# EAGLE board 030Card (EAGLE 8.2.2), part 1 of 2
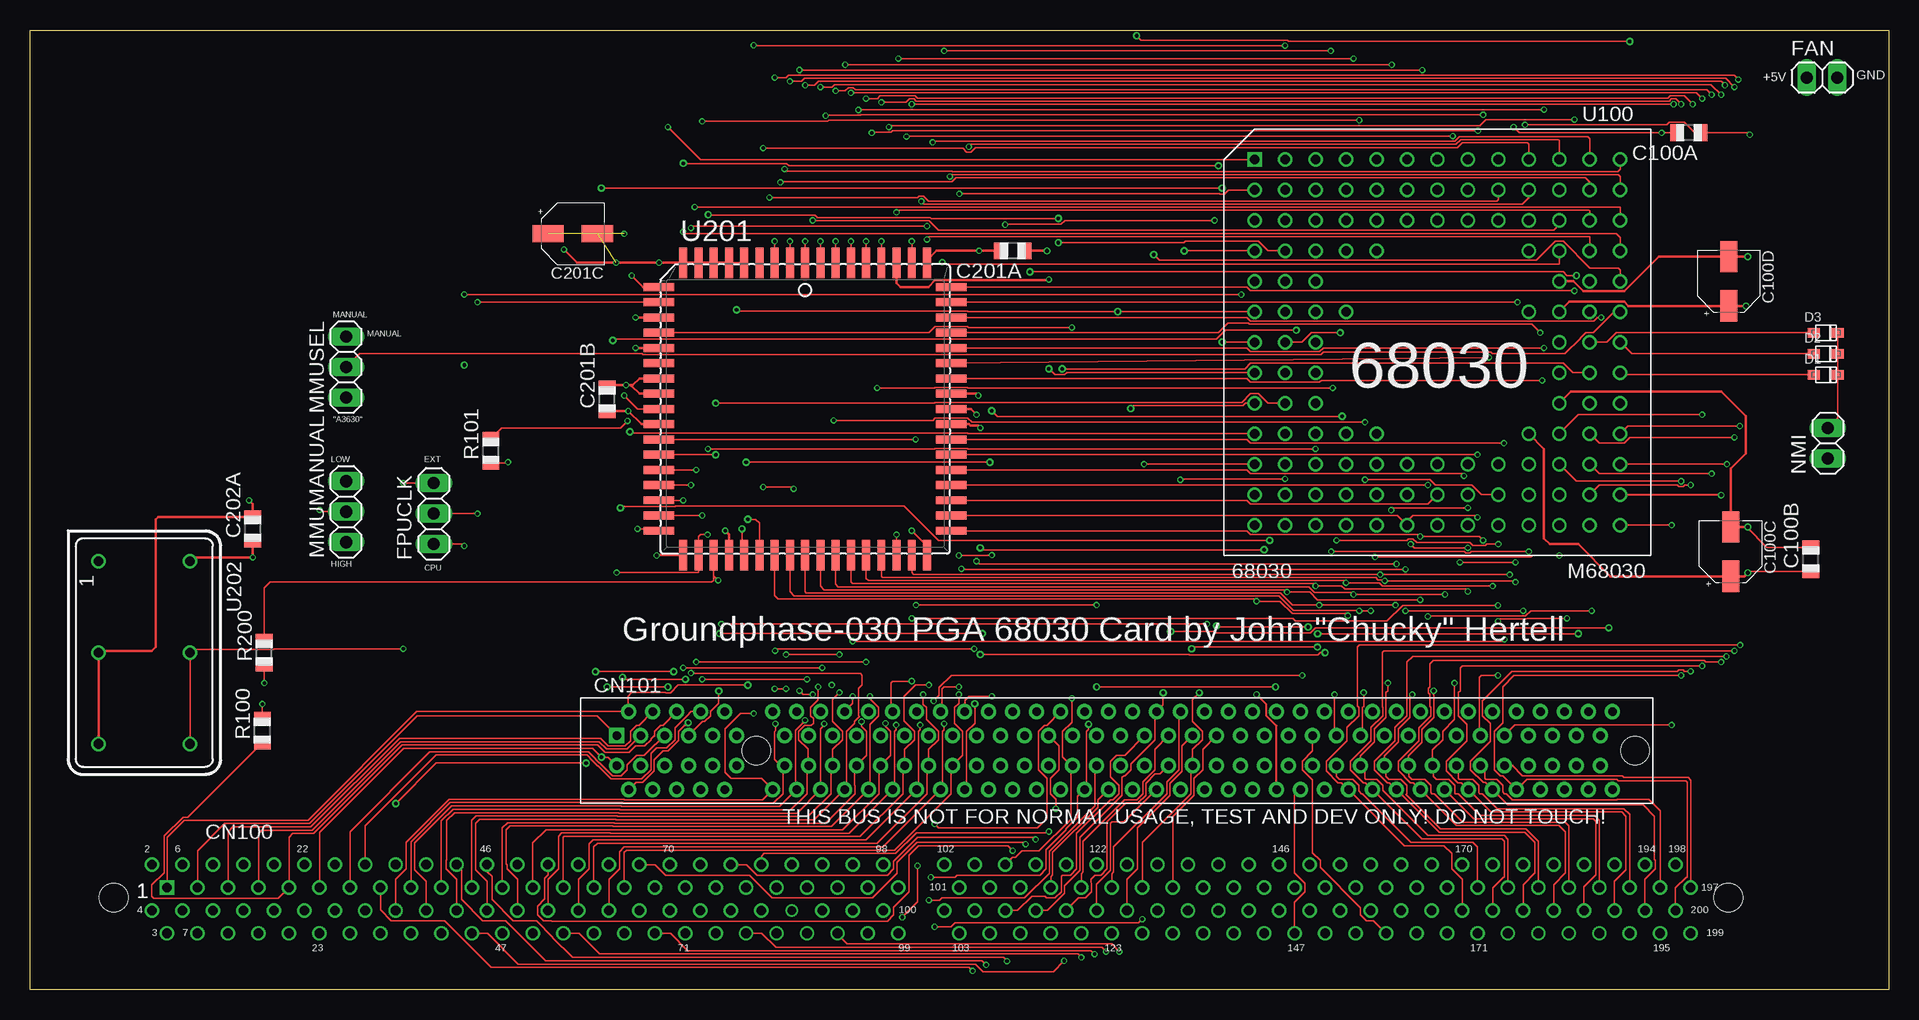
[diagram p2: board, top side]
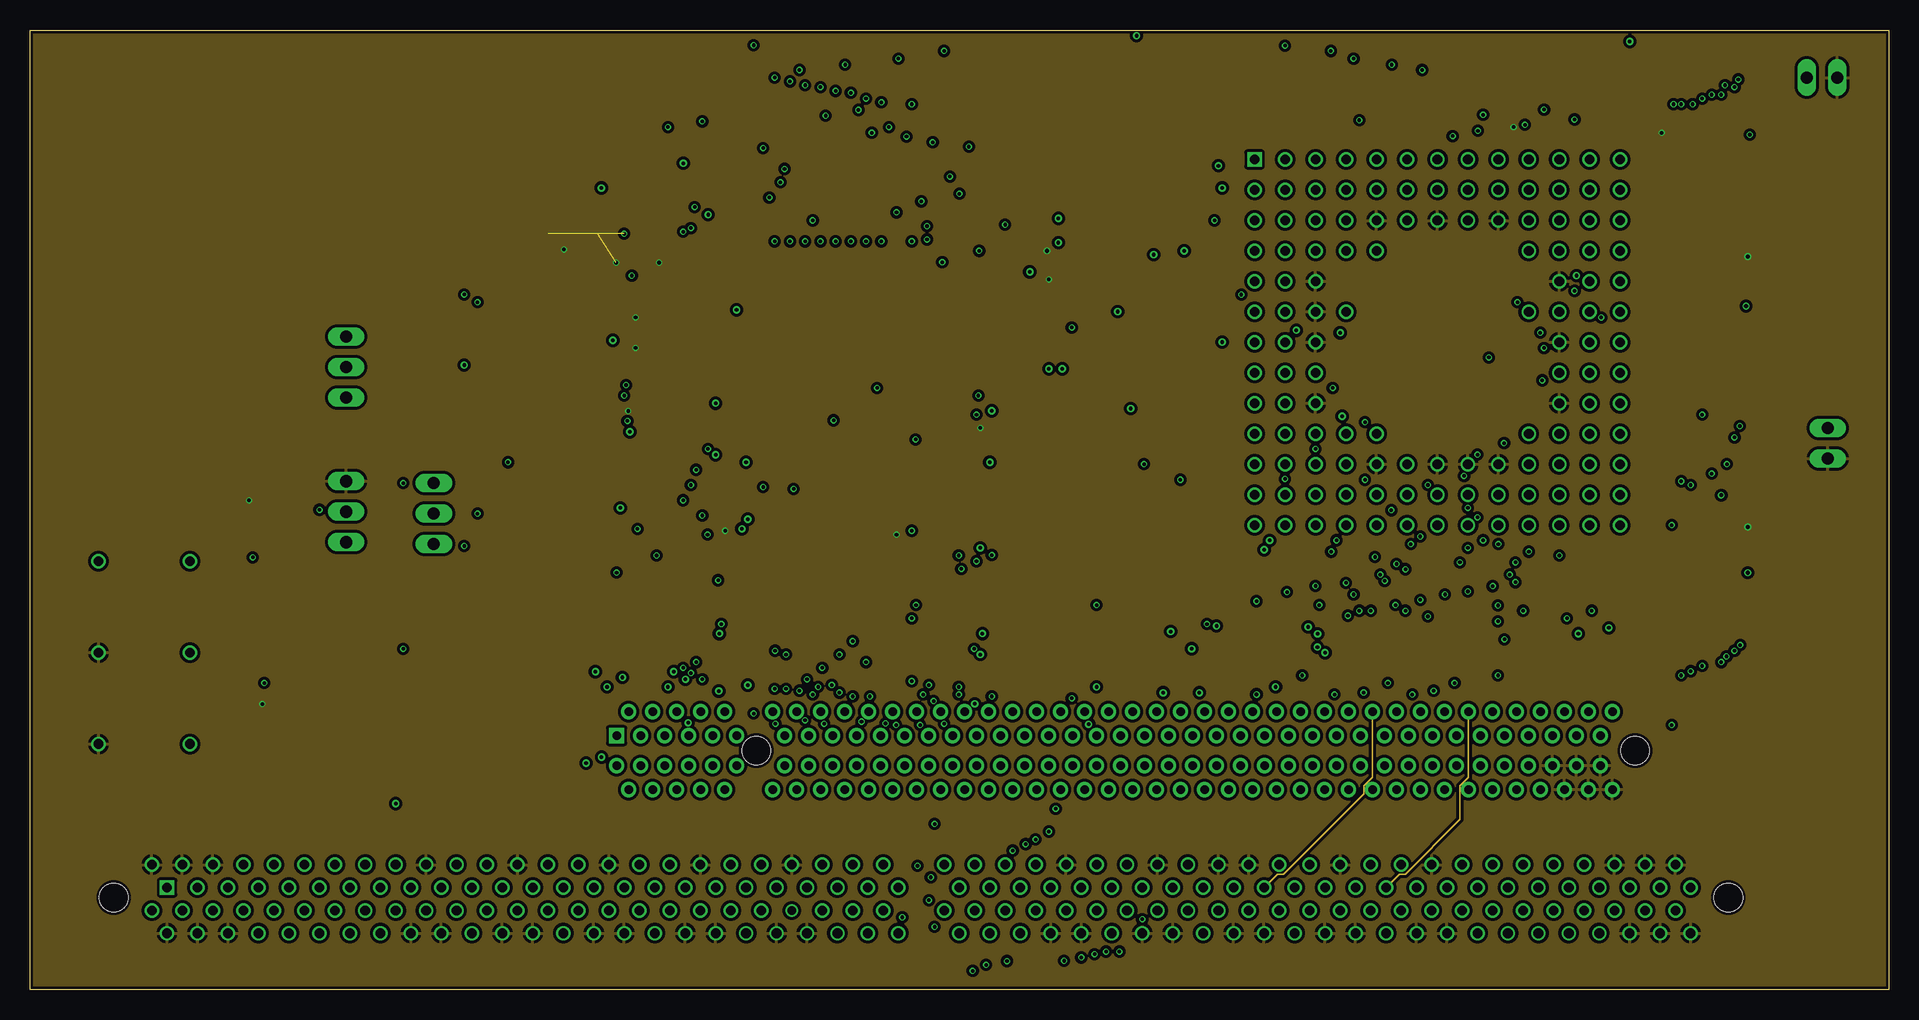
[diagram p3: board, inner layer Route2]
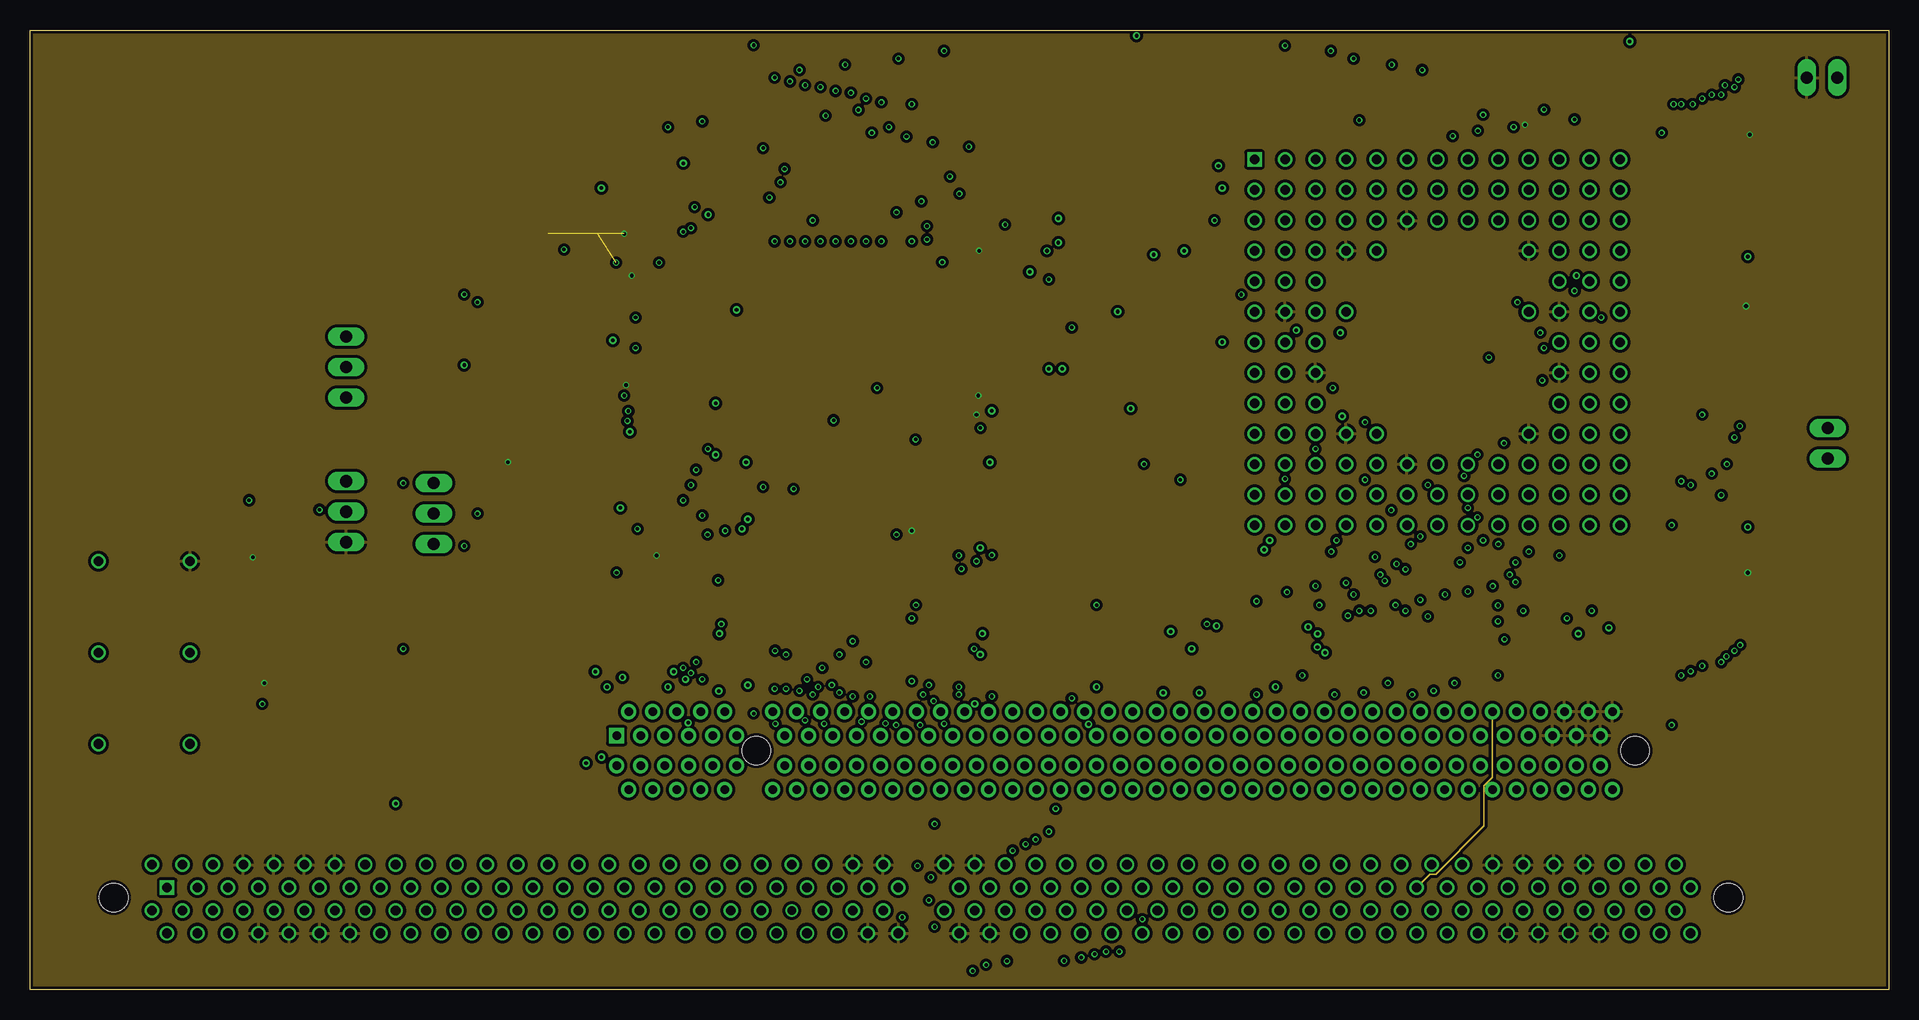
[diagram p4: board, inner layer Route15]
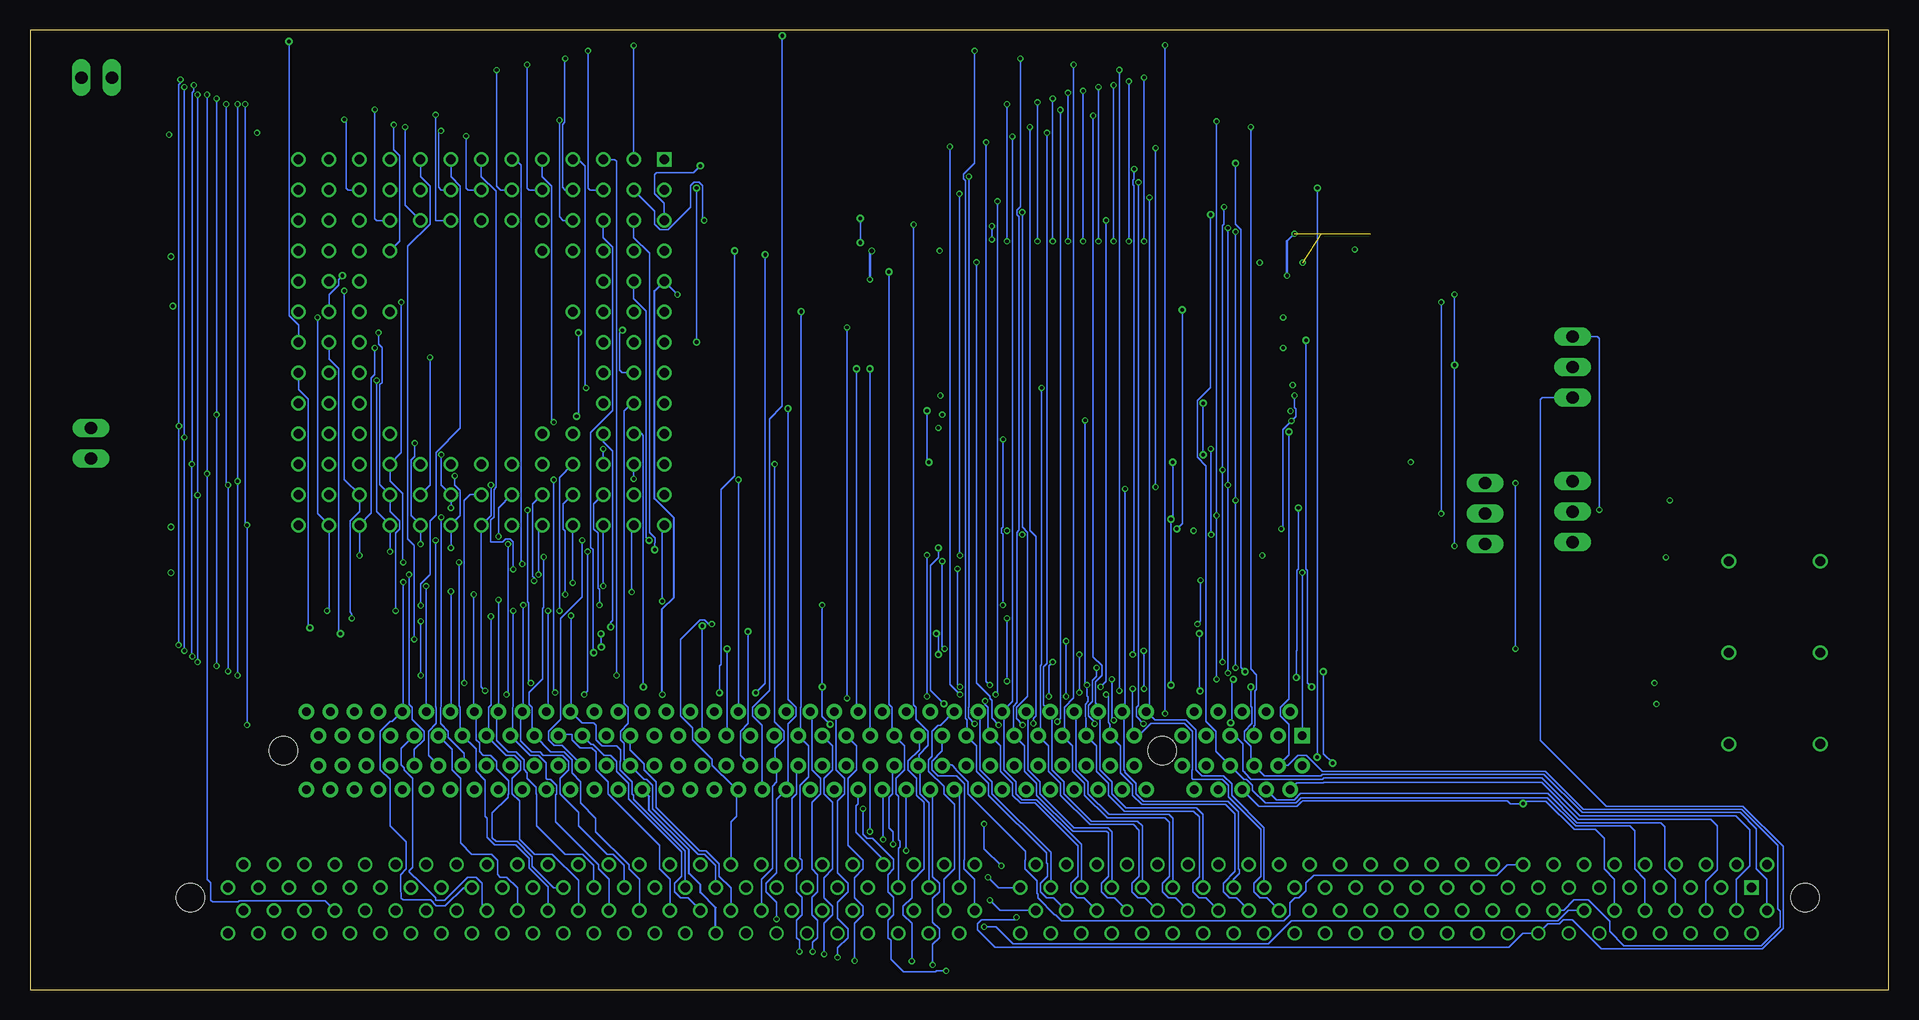
[diagram p5: board, bottom side, seen from below]

Size 154.94 x 80.01 mm. Coordinates in mm from the lower left corner, seen from the top.
Outline: 154.94,0 0,0 0,80.01 154.94,80.01 154.94,0
Copper layers (1*2*15*16): Top 0.035mm / dielectric 0.2mm / Route2 0.0175mm / dielectric 0.3mm / Route15 0.0175mm / dielectric 0.2mm / Bottom 0.035mm
Design rules "saved": minimum track width 5mil, minimum drill 10mil, track to track 5mil, track to pad 5mil, pad to pad 5mil, via to via 5mil, smd to smd 0mil, copper to edge 5mil, drill to drill 6mil, minimum pad ring 5mil, minimum via ring 4mil, stop-mask expansion 4mil, vias tented up to drill 25mil, thermal gap 10mil

## Footprints (pad centres in the part's own frame; a part is rotated, then mirrored left to right if it is on the bottom)
R0805 = smd 1.1 x 1.4: 1 -1,0; 2 1,0
SMD-ELECTROLYTE = smd 2.6 x 1.4: + 2.05,0; - -2.05,0
KEL8817-200-170S-F = drill 0.8: 58 -27.94,2.794; 70 -20.32,2.794; 90 -7.62,2.794; 111 8.89,-2.921; 122 15.24,2.794; 123 16.51,-2.921; 146 30.48,2.794; 150 33.02,2.794; 158 38.1,2.794; 162 40.64,2.794; 170 45.72,2.794; 171 46.99,-2.921; +5V-0 -55.88,2.794; +5V-1 -53.34,2.794; +5V-2 -50.8,2.794; +5V-3 -48.26,2.794; +5V-4 -5.08,2.794; +5V-5 -2.54,2.794; +5V-6 2.54,2.794; +5V-7 5.08,2.794; +5V-8 48.26,2.794; +5V-9 50.8,2.794; +5V-10 53.34,2.794; +5V-11 55.88,2.794; +5V-12 57.15,-2.921; +5V-13 54.61,-2.921; +5V-14 52.07,-2.921; +5V-15 49.53,-2.921; +5V-16 6.35,-2.921; +5V-17 3.81,-2.921; +5V-18 -1.27,-2.921; +5V-19 -3.81,-2.921; +5V-20 -46.99,-2.921; +5V-21 -49.53,-2.921; +5V-22 -52.07,-2.921; +5V-23 -54.61,-2.921; _AS 24.13,0.889; _AVEC -58.42,-1.016; _BERR -44.45,0.889; _BG 6.35,0.889; _BG30 39.37,-2.921; _BGACK -60.96,-1.016; _BOSS -52.07,0.889; _BR -46.99,0.889; _CBACK -48.26,-1.016; _CBR 31.75,-2.921; _CBREQ -45.72,-1.016; _CIIN 20.32,-1.016; _CIOUT 3.81,0.889; _CPURST 8.89,0.889; _DBEN 2.54,-1.016; _DMAEN -21.59,-2.921; _DS -1.27,0.889; _DSACK0 -6.35,-2.921; _EBCLR 11.43,0.889; _ECS -2.54,-1.016; _EMUL -44.45,-2.921; _FPUCS 22.86,2.794; _FPURST 7.62,2.794; _HLT -63.5,-1.016; _INT2 -12.7,2.794; _INT6 -36.83,-2.921; _IPEND 10.16,-1.016; _IPL0 12.7,-1.016; _IPL1 15.24,-1.016; _IPL2 17.78,-1.016; _OCS 22.86,-1.016; _PI2C+ -13.97,-2.921; _PLSTERM -49.53,0.889; _RAMSLOT -55.88,-1.016; _RESET 13.97,0.889; _RMC 5.08,-1.016; _SBR -57.15,0.889; _SCSI -22.86,2.794; _SENSEZ3P+ 10.16,2.794; _WAIT -29.21,-2.921; A0 -43.18,-1.016; A1 -40.64,-1.016; A2 -38.1,-1.016; A3 -35.56,-1.016; A4 -33.02,-1.016; A5 -30.48,-1.016; A6 -27.94,-1.016; A7 -25.4,-1.016; A8 -41.91,0.889; A9 -39.37,0.889; A10 -36.83,0.889; A11 -34.29,0.889; A12 -31.75,0.889; A13 -29.21,0.889; A14 -26.67,0.889; A15 -24.13,0.889; A16 -21.59,0.889; A17 -19.05,0.889; A18 -16.51,0.889; A19 -13.97,0.889; A20 -11.43,0.889; A21 -8.89,0.889; A22 -6.35,0.889; A23 -3.81,0.889; A24 -22.86,-1.016; A25 -20.32,-1.016; A26 -17.78,-1.016; A27 -15.24,-1.016; A28 -12.7,-1.016; A30 -7.62,-1.016; A31 -5.08,-1.016; CLK90 17.78,2.794; CPUCLK 24.13,-2.921; D0 45.72,-1.016; D1 48.26,-1.016; D2 50.8,-1.016; D3 53.34,-1.016; D4 55.88,-1.016; D5 58.42,-1.016; D6 60.96,-1.016; D7 63.5,-1.016; D8 43.18,-1.016; D9 40.64,-1.016; D10 38.1,-1.016; D11 35.56,-1.016; D12 33.02,-1.016; D13 30.48,-1.016; D14 27.94,-1.016; D15 25.4,-1.016; D16 46.99,0.889; D17 49.53,0.889; D18 52.07,0.889; D19 54.61,0.889; D20 57.15,0.889; D21 59.69,0.889; D22 62.23,0.889; D23 64.77,0.889; D24 44.45,0.889; D25 41.91,0.889; D26 39.37,0.889; D27 36.83,0.889; D28 34.29,0.889; D29 31.75,0.889; D30 29.21,0.889; D31 26.67,0.889; DIS_CLK30 -15.24,2.794; DIS_CLKS -45.72,2.794; ECLK30 -43.18,2.794; ECLK90 -35.56,2.794; ECLK90A -38.1,2.794; ECPUCLKA -30.48,2.794; EXT90 -54.61,0.889; EXTCPU 7.62,-1.016; FC0 -53.34,-1.016; FC1 -50.8,-1.016; FC2 19.05,0.889; GND0 -63.5,2.794; GND1 -60.96,2.794; GND2 -58.42,2.794; GND3 -40.64,2.794; GND4 -33.02,2.794; GND5 -25.4,2.794; GND6 -17.78,2.794; GND7 -10.16,2.794; GND8 12.7,2.794; GND9 20.32,2.794; GND10 25.4,2.794; GND11 27.94,2.794; GND12 35.56,2.794; GND13 43.18,2.794; GND14 58.42,2.794; GND15 60.96,2.794; GND16 63.5,2.794; GND17 64.77,-2.921; GND18 62.23,-2.921; GND19 59.69,-2.921; GND20 44.45,-2.921; GND21 41.91,-2.921; GND22 36.83,-2.921; GND23 34.29,-2.921; GND24 29.21,-2.921; GND25 26.67,-2.921; GND26 21.59,-2.921; GND27 19.05,-2.921; GND28 13.97,-2.921; GND29 11.43,-2.921; GND30 -8.89,-2.921; GND31 -11.43,-2.921; GND32 -16.51,-2.921; GND33 -19.05,-2.921; GND34 -24.13,-2.921; GND35 -26.67,-2.921; GND36 -31.75,-2.921; GND37 -34.29,-2.921; GND38 -39.37,-2.921; GND39 -41.91,-2.921; GND40 -57.15,-2.921; GND41 -59.69,-2.921; GND42 -62.23,-2.921; R_W -59.69,0.889; SIZ0 16.51,0.889; SIZ1 21.59,0.889 | drill 0.8 square: _DSACK1 -62.23,0.889 | drill 0.7: A29 -10.16,-1.016 | hole 2.362: 67.903,0.042; -66.68,0.042
OPTIONBUS = drill 0.7 pad 1.27 square: A1 -40,1.5 | drill 0.7 pad 1.27: A2 -39,3.5; A3 -38,1.5; A4 -37,3.5; A5 -36,1.5; A6 -35,3.5; A7 -34,1.5; A8 -33,3.5; A9 -32,1.5; A10 -31,3.5; A11 -30,1.5; A12 -27,3.5; A13 -26,1.5; A14 -25,3.5; A15 -24,1.5; A16 -23,3.5; A17 -22,1.5; A18 -21,3.5; A19 -20,1.5; A20 -19,3.5; A21 -18,1.5; A22 -17,3.5; A23 -16,1.5; A24 -15,3.5; A25 -14,1.5; A26 -13,3.5; A27 -12,1.5; A28 -11,3.5; A29 -10,1.5; A30 -9,3.5; A31 -8,1.5; A32 -7,3.5; A33 -6,1.5; A34 -5,3.5; A35 -4,1.5; A36 -3,3.5; A37 -2,1.5; A38 -1,3.5; A39 0,1.5; A40 1,3.5; A41 2,1.5; A42 3,3.5; A43 4,1.5; A44 5,3.5; A45 6,1.5; A46 7,3.5; A47 8,1.5; A48 9,3.5; A49 10,1.5; A50 11,3.5; A51 12,1.5; A52 13,3.5; A53 14,1.5; A54 15,3.5; A55 16,1.5; A56 17,3.5; A57 18,1.5; A58 19,3.5; A59 20,1.5; A60 21,3.5; A61 22,1.5; A62 23,3.5; A63 24,1.5; A64 25,3.5; A65 26,1.5; A66 27,3.5; A67 28,1.5; A68 29,3.5; A69 30,1.5; A70 31,3.5; A71 32,1.5; A72 33,3.5; A73 34,1.5; A74 35,3.5; A75 36,1.5; A76 37,3.5; A77 38,1.5; A78 39,3.5; A79 40,1.5; A80 41,3.5; A81 42,1.5; A82 43,3.5; B1 -40,-1; B2 -39,-3; B3 -38,-1; B4 -37,-3; B5 -36,-1; B6 -35,-3; B7 -34,-1; B8 -33,-3; B9 -32,-1; B10 -31,-3; B11 -30,-1; B12 -27,-3; B13 -26,-1; B14 -25,-3; B15 -24,-1; B16 -23,-3; B17 -22,-1; B18 -21,-3; B19 -20,-1; B20 -19,-3; B21 -18,-1; B22 -17,-3; B23 -16,-1; B24 -15,-3; B25 -14,-1; B26 -13,-3; B27 -12,-1; B28 -11,-3; B29 -10,-1; B30 -9,-3; B31 -8,-1; B32 -7,-3; B33 -6,-1; B34 -5,-3; B35 -4,-1; B36 -3,-3; B37 -2,-1; B38 -1,-3; B39 0,-1; B40 1,-3; B41 2,-1; B42 3,-3; B43 4,-1; B44 5,-3; B45 6,-1; B46 7,-3; B47 8,-1; B48 9,-3; B49 10,-1; B50 11,-3; B51 12,-1; B52 13,-3; B53 14,-1; B54 15,-3; B55 16,-1; B56 17,-3; B57 18,-1; B58 19,-3; B59 20,-1; B60 21,-3; B61 22,-1; B62 23,-3; B63 24,-1; B64 25,-3; B65 26,-1; B66 27,-3; B67 28,-1; B68 29,-3; B69 30,-1; B70 31,-3; B71 32,-1; B72 33,-3; B73 34,-1; B74 35,-3; B75 36,-1; B76 37,-3; B77 38,-1; B78 39,-3; B79 40,-1; B80 41,-3; B81 42,-1; B82 43,-3 | hole 2.35: -28.35,0.25; 44.9,0.25
SOD-323F = smd 1 x 0.8: A -1,0; C 1,0
1X2PIN = drill 1.016 long: 1 -1.27,0; 2 1.27,0
1X3PIN = drill 1.016 long: 1 -2.54,0; 2 0,0; 3 2.54,0
M68030 = drill 0.8: _AS 12.7,5.08; _AVEC 12.7,-5.08; _BERR 15.24,2.54; _BG 12.7,-12.7; _BGACK 10.16,-10.16; _CBACK 15.24,5.08; _CBREQ 15.24,7.62; _CDIS -12.7,2.54; _CIIN 15.24,10.16; _CIOUT 12.7,-10.16; _DBEN 15.24,12.7; _DS 12.7,7.62; _DSACK0 15.24,-2.54; _DSACK1 12.7,0; _ECS 12.7,12.7; _HALT 12.7,2.54; _IPEND -15.24,-5.08; _IPL0 -15.24,2.54; _IPL1 -15.24,0; _IPL2 -12.7,0; _MMUDIS -15.24,-2.54; _OCS 10.16,-7.62; _REFILL -15.24,5.08; _RESET -12.7,-2.54; _RMC 15.24,-12.7; _STATUS -12.7,5.08; _STERM 15.24,0; A0 12.7,-15.24; A1 7.62,-10.16; A2 -15.24,-7.62; A3 -12.7,-7.62; A4 -15.24,-10.16; A5 -12.7,-10.16; A6 -10.16,-7.62; A7 -15.24,-12.7; A8 -12.7,-12.7; A9 -10.16,-10.16; A10 -15.24,-15.24; A11 -7.62,-10.16; A12 -10.16,-12.7; A13 -12.7,-15.24; A14 -7.62,-12.7; A15 -10.16,-15.24; A16 -5.08,-12.7; A17 -7.62,-15.24; A18 -2.54,-10.16; A19 -5.08,-15.24; A20 -2.54,-12.7; A21 -2.54,-15.24; A22 0,-12.7; A23 0,-15.24; A24 2.54,-15.24; A25 2.54,-12.7; A26 5.08,-15.24; A27 5.08,-12.7; A28 7.62,-15.24; A29 7.62,-12.7; A30 10.16,-15.24; A31 10.16,-12.7; CLK 15.24,-5.08; D0 -15.24,7.62; D1 -12.7,7.62; D2 -15.24,10.16; D3 -15.24,12.7; D4 -12.7,10.16; D5 -10.16,7.62; D6 -12.7,12.7; D7 -10.16,10.16; D8 -15.24,15.24; D9 -10.16,12.7; D10 -7.62,10.16; D11 -12.7,15.24; D12 -7.62,12.7; D13 -10.16,15.24; D14 -5.08,12.7; D15 -7.62,15.24; D16 -5.08,15.24; D17 -2.54,12.7; D18 -2.54,15.24; D19 0,15.24; D20 0,12.7; D21 2.54,15.24; D22 2.54,12.7; D23 5.08,15.24; D24 5.08,12.7; D25 7.62,15.24; D26 10.16,15.24; D27 7.62,12.7; D28 12.7,15.24; D29 10.16,12.7; D30 7.62,10.16; D31 15.24,15.24; FC0 12.7,-7.62; FC1 15.24,-10.16; FC2 15.24,-7.62; GND1 5.08,-10.16; GND2 0,-10.16; GND3 -5.08,-10.16; GND4 10.16,-5.08; GND5 -10.16,-5.08; GND6 10.16,-2.54; GND7 10.16,0; GND8 -10.16,0; GND9 10.16,5.08; GND10 -10.16,5.08; GND11 5.08,10.16; GND12 0,10.16; GND13 -2.54,10.16; GND14 -5.08,10.16; NC1 5.08,-7.62; NC2 -12.7,-5.08; NC3 -7.62,-2.54; NC4 7.62,-2.54; NC5 5.08,7.62; R_W 10.16,10.16; SIZ0 12.7,10.16; SIZ1 10.16,7.62; VCC1 2.54,-10.16; VCC2 -7.62,-7.62; VCC3 7.62,-7.62; VCC4 -10.16,-2.54; VCC5 12.7,-2.54; VCC6 -10.16,2.54; VCC7 10.16,2.54; VCC8 -7.62,7.62; VCC9 7.62,7.62; VCC11 2.54,10.16 | drill 0.8 square: _BR 15.24,-15.24
M68882PLCC = smd 2.54 x 0.66: _AS -12.192,-3.81; _DS -12.192,-2.54; _RESET -12.192,6.35; A0 -12.192,-10.16; A1 -12.192,-8.89; A2 -12.192,-7.62; A3 -12.192,-6.35; A4 -12.192,-5.08; CLK -12.192,8.89; D9 12.192,10.16; D10 12.192,8.89; D11 12.192,7.62; D12 12.192,6.35; D13 12.192,5.08; D14 12.192,3.81; D15 12.192,2.54; D16 12.192,-2.54; D17 12.192,-3.81; D18 12.192,-5.08; D19 12.192,-6.35; D20 12.192,-7.62; D21 12.192,-8.89; D22 12.192,-10.16; GND6 -12.192,7.62; GND7 -12.192,5.08; GND8 -12.192,-1.27; GND11 12.192,-1.27; NC1 -12.192,3.81; SIZE -12.192,0; VCC1 -12.192,10.16; VCC2 -12.192,2.54; VCC3 -12.192,1.27; VCC6 12.192,0; VCC7 12.192,1.27 | smd 0.66 x 2.54: _CS -7.62,-12.192; _DSACK0 -5.08,-12.192; _DSACK1 -3.81,-12.192; _SENSE -3.81,12.192; D0 -2.54,12.192; D1 -1.27,12.192; D2 0,12.192; D3 1.27,12.192; D4 2.54,12.192; D5 3.81,12.192; D6 5.08,12.192; D7 6.35,12.192; D8 8.89,12.192; D23 8.89,-12.192; D24 6.35,-12.192; D25 5.08,-12.192; D26 3.81,-12.192; D27 2.54,-12.192; D28 1.27,-12.192; D29 0,-12.192; D30 -1.27,-12.192; D31 -2.54,-12.192; GND1 -5.08,12.192; GND2 -6.35,12.192; GND3 -7.62,12.192; GND4 -8.89,12.192; GND5 -10.16,12.192; GND9 -6.35,-12.192; GND10 7.62,-12.192; GND12 7.62,12.192; R_W -8.89,-12.192; VCC4 -10.16,-12.192; VCC5 10.16,-12.192; VCC8 10.16,12.192
OSCILLATOR = drill 0.813: 1 -7.62,-3.81; 4 0,-3.81; 7 7.62,-3.81; 8 7.62,3.81; 11 0,3.81; 14 -7.62,3.81

## Placement (x,y rotation side)
C100A  220pF  [R0805]  138.27,71.44 180 top
C100B  0.22uF  [R0805]  148.43,35.88 90 top
C100C  22uF  [SMD-ELECTROLYTE]  141.76,36.51 270 top
C100D  22uF  [SMD-ELECTROLYTE]  141.6,59.05 270 top
C201A  220pF  [R0805]  81.92,61.59 180 top
C201B  0.22uF  [R0805]  48.1,49.21 90 top
C201C  22uF  [SMD-ELECTROLYTE]  45.24,63.02 180 top
C202A  0.01uF  [R0805]  18.57,38.42 90 top
CN100  KEL8817-200-170S-F  [KEL8817-200-170S-F]  73.66,7.62 0 top
CN101  OPTIONBUS  [OPTIONBUS]  88.9,19.68 0 top
D1  [SOD-323F]  149.7,51.28 0 top
D2  [SOD-323F]  149.7,53.02 0 top
D3  [SOD-323F]  149.7,54.77 0 top
FAN  1X2PIN  [1X2PIN]  149.38,76.04 0 top
FPUCLK  1X3PIN  [1X3PIN]  33.66,39.69 90 top
MMUMANUAL  1X3PIN  [1X3PIN]  26.35,39.85 90 top
MMUSEL  1X3PIN  [1X3PIN]  26.35,51.91 90 top
NMI  1X2PIN  [1X2PIN]  149.86,45.56 90 top
R100  100  [R0805]  19.37,21.59 90 top
R101  4.7K  [R0805]  38.42,44.93 90 top
R200  4.7K  [R0805]  19.53,28.1 90 top
U100  M68030  [M68030]  117.32,53.98 180 top
U201  M68882PLCC  [M68882PLCC]  64.61,48.42 0 top
U202  OSCILLATOR  [OSCILLATOR]  9.52,28.1 270 top

## Tracks (layer width: path | path; a pad name or v marks a point on that pad's centre or on a via)
+5V  (via drill 0.3, 0.35)  (1 unrouted)
  Top 0.127: U201.VCC5 74.77,36.99 | R101.1 39.8,43.93 v39.85,43.97 | R200.1 v19.53,25.56 | v143.35,71.28 143.19,71.44 C100A.1 138.79,71.44 137.9,72.33 136.64,72.33 136.42,72.11 v124.62,72.11 | C100B.1 143.3,34.88 v143.19,34.77
  Top 0.178: 74.77,36.99 v73.5,38.26
  Top 0.203: U201.VCC8 74.77,60.8 75.56,61.59 v79.12,61.59 C201A.2 | U201.VCC1 51.12,58.58 v50.17,59.53 | U201.VCC2 50.8,50.96 50.24,50.4 | 50.24,50.4 50.17,50.32 50.8,49.69 U201.VCC3 | 50.24,50.4 v49.69,50.4 48.29,50.4 C201B.2 | U201.VCC4 52.26,36.23 v52.23,36.2 | U201.VCC7 78.9,49.69 v79.06,49.53 | U201.VCC6 78.42,48.42 v78.9,47.94 | C202A.1 v18.57,36.04 13.65,36.04 U202.14 | U100.VCC8 126.21,45.09 126.21,37.62 126.68,37.15 129.06,37.15 131.75,34.46 C100C.+ 142.89,34.46 v143.19,34.77 | U100.VCC4 128.31,57.34 132.9,57.34 133.24,57.01 C100D.+ 143.02,57.01 v143.03,56.99
  Bottom 0.127: v124.62,72.11 124.62,70.02 124.15,69.54 124.15,62.39 U100.VCC2
  Bottom 0.203: v50.17,59.53 50.17,62.39 v49.53,63.02
  pour Route15 (isolate 0.254): 0,0 0,80.01 154.94,80.01 154.94,0
_AS  (via drill 0.3 pad 0.6)
  Top 0.127: v57.15,48.9 75.41,48.9 75.45,48.94 101,48.94 101.75,49.69 102.4,49.69 103.19,48.9 U100._AS | v57.15,44.59 51.77,44.59 51.75,44.61 U201._AS
  Bottom 0.127: CN100._AS 97.79,10.37 98.7,11.28 99.24,11.28 103.03,15.08 103.03,17.02 103.55,17.54 103.75,17.54 104.88,18.66 | 104.88,18.66 CN101.B55 | v57.15,48.9 v57.15,44.59 | U100._AS 104.78,48.9 105.41,48.26 105.41,23.86 105.07,23.53 105.07,22.18 105.73,21.53 105.73,20.84 105.41,20.53 105.41,19.2 104.88,18.66
_AVEC  (via drill 0.3 pad 0.6)
  Top 0.127: v103.33,37.45 75.73,37.45 72.87,40.32 53.81,40.32 53.77,40.28 49.33,40.28 v49.21,40.16 | CN101.B2 50.52,17.3 51.08,17.3 52,18.23 52,19.14 52.77,19.91 53.19,19.91 54.07,20.8 54.07,21.53 54.56,22.01 54.62,22.01 v54.86,22.25 | v54.64,25.88 49.54,25.88 v49.39,26.04
  Bottom 0.127: CN100._AVEC 15.24,9.05 14.29,10 14.29,13.65 14.84,14.21 25.87,14.21 28.93,17.27 47.1,17.27 47.11,17.26 49.33,17.26 CN101.B2 | v103.33,37.45 103.57,37.69 103.57,56.59 104.62,57.63 U100._AVEC | v49.21,40.16 49.21,35.07 49.34,34.95 49.34,28.29 49.39,28.24 v49.39,26.04 | v54.86,22.25 54.86,22.45 54.77,22.54 54.77,25.74 v54.64,25.88
_BERR  (via drill 0.3, 0.3 pad 0.6)
  Top 0.127: CN100._BERR 29.21,6.64 30.12,5.73 34.56,5.73 38.45,1.85 78.29,1.85 v78.58,1.56 | v85.5,15.08 85.5,15.88 85.05,16.33 85.05,17.63 85.75,18.33 85.75,20.33 CN101.A35 | U100._BERR 86.42,51.44 86.25,51.26 85.42,51.26 v84.93,51.75
  Bottom 0.127: v78.58,1.56 79.39,1.56 79.46,1.5 82.14,1.5 83.19,2.54 83.19,4.1 83.42,4.34 83.42,5.77 82.95,6.24 82.95,7.68 83.42,8.15 83.42,9.58 82.95,10.05 82.95,10.85 84.71,12.61 85.17,12.61 85.5,12.94 v85.5,15.08 | v84.93,51.75 84.93,21.22 CN101.A35
_BG  (via drill 0.3)
  Top 0.127: v81.28,63.78 81.3,63.8 85.93,63.8 86.26,64.14 v98.74,64.14
  Bottom 0.127: CN100._BG 80.01,15.59 80.75,16.33 80.75,18.54 80.85,18.64 | 80.85,18.64 CN101.B31 | v98.74,64.14 98.89,64.28 98.89,67.04 99.17,67.32 99.58,67.32 99.87,67.04 99.87,65.22 101.75,63.34 102.4,63.34 102.87,63.81 102.87,64.92 U100._BG | v81.28,63.78 81.28,23.73 81.07,23.53 81.07,22.53 80.07,21.53 80.07,20.37 80.85,19.59 80.85,18.64
_BG30
  Top 0.127: CN100._BG30 112,5.73 111.4,5.73 110.89,6.24 110.89,6.84 107.55,10.18 107.55,10.77 106.9,11.42 106.9,17.48 106.05,18.33 106.05,19.04 106.9,19.89 CN101.A57
_BGACK  (via drill 0.3 pad 0.6)
  Top 0.127: v107.95,28.1 107.55,28.1 107.37,27.93 96.63,27.93 96.62,27.94 v79.22,27.94 | v79.39,29.69 v57.47,29.69 | v57.41,24.89 57.41,23.87 56.72,23.18 56.72,22.84 56.24,22.36 56.07,22.36 CN101.A7
  Bottom 0.127: CN100._BGACK 12.7,9.18 11.83,10.05 11.83,10.08 11.59,10.32 11.59,13.34 12.74,14.48 25.76,14.48 28.93,17.66 47.1,17.66 47.23,17.54 53.15,17.54 53.69,18.07 | 53.69,18.07 53.73,18.11 | 53.69,18.07 53.66,18.1 53.82,18.26 53.82,20.48 54.45,21.11 54.77,21.11 CN101.A7 | U100._BGACK 107.16,62.71 106.37,61.92 106.37,48.26 108.2,46.43 108.2,36.88 108.02,36.7 108.02,28.17 v107.95,28.1 | v79.22,27.94 79.22,29.51 v79.39,29.69 | v57.47,29.69 57.47,24.95 v57.41,24.89
_BOSS
  Top 0.127: CN101.A6 52.75,22.04 52.55,22.04 52.05,21.54 52.05,21.19 | 52.05,21.19 52.05,21.13 | 52.05,21.19 51.75,20.89 51.75,20.83 51.24,20.32 50.48,20.32 49.94,19.77 47.94,19.77 47.32,20.4 31.03,20.4 23.64,13.01 21.9,13.01 21.59,12.7 CN100._BOSS 20.7,7.62 10.32,7.62 10.16,7.78 10.16,8.73 11.18,9.75 11.18,12.8 12.75,14.38 13.16,14.38 R100.1
_BR  (via drill 0.3)
  Top 0.127: CN100._BR 26.67,13.18 33.33,19.84 46.54,19.84 47.15,19.23 47.15,19.18 47.44,18.89 47.49,18.89 48.55,17.83 49.25,17.83 49.75,18.33 49.75,18.74 50.55,19.54 51.21,19.54 52.11,20.44 52.16,20.44 CN101.A5 | U100._BR 55.88,69.22 v53.18,71.91
  Bottom 0.127: v53.18,71.91 53.18,26.73 52.69,26.24 52.69,25.04 52.82,24.91 52.82,22.07 52.9,21.99 CN101.A5
_CBACK  (via drill 0.3, 0.3 pad 0.6)
  Top 0.127: v75.41,5.24 76.78,5.24 77.11,5.57 92.41,5.57 v92.71,5.87 | U100._CBACK 101.32,48.9 101.11,48.69 91.99,48.69 v91.76,48.45
  Bottom 0.127: CN100._CBACK 26.71,6.6 27.58,5.73 49.81,5.73 51.71,3.83 73.01,3.83 74.42,5.24 v75.41,5.24 | v92.71,5.87 92.71,7.28 93.58,8.15 93.58,8.87 92.71,9.74 92.71,15.88 CN101.B42 91.76,16.83 91.76,22.16 91.07,22.84 91.07,23.53 91.76,24.21 v91.76,48.45
_CBR
  Top 0.127: CN101.B56 105.41,16.2 105.41,9.74 106.28,8.87 106.28,8.15 105.41,7.28 CN100._CBR
_CBREQ  (via drill 0.3 pad 0.6)
  Top 0.127: U100._CBREQ 78.2,46.35 78.15,46.4 50.12,46.4 v50.01,46.51
  Bottom 0.127: CN100._CBREQ 27.11,6.6 26.23,7.47 25.04,7.47 23.26,5.69 23.26,4.84 22.07,3.65 10.64,3.65 9.05,5.24 9.05,6.53 9.24,6.73 9.24,12.02 12.27,15.04 25.44,15.04 28.62,18.22 47.23,18.22 48.55,19.54 49.25,19.54 50.1,18.68 CN101.B3 50.01,19.58 50.01,22.12 50.72,22.84 50.72,23.53 50.01,24.25 v50.01,46.51
_CIIN  (via drill 0.3)
  Top 0.127: U100._CIIN v92.87,43.81
  Bottom 0.127: CN100._CIIN 93.98,9.18 93.05,10.12 93.05,16.96 92.71,17.3 92.71,18.5 92.82,18.6 | 92.82,18.6 CN101.B43 | v92.87,43.81 92.87,22.32 92.07,21.53 92.07,20.84 92.82,20.1 92.82,18.6
_CIOUT  (via drill 0.3 pad 0.6)
  Top 0.127: v102.87,36.67 79.38,36.67 v79.22,36.83 | v78.76,23.83 78.76,22.21 78.07,21.53 78.07,16.86 CN101.B28
  Bottom 0.127: CN100._CIOUT 77.47,16.25 CN101.B28 | U100._CIOUT 104.62,62.71 103.31,61.41 103.31,38.13 102.84,37.66 102.84,37.25 102.87,37.22 v102.87,36.67 | v79.22,36.83 79.22,36.03 79.88,35.36 79.88,24.95 v78.76,23.83
_CPURST  (via drill 0.3 pad 0.6)
  Top 0.127: v128.91,59.53 128.12,59.53 127.8,59.85 v83.35,59.85 v83.34,59.85
  Bottom 0.127: CN100._CPURST 82.55,11.77 82.43,11.89 82.43,12.37 82.55,12.49 82.55,16.13 82.75,16.33 82.75,17.63 82.05,18.33 82.05,20.33 82.8,21.08 | 82.8,21.08 CN101.A33 | v128.91,59.53 129.23,59.21 129.23,58.73 130.02,57.94 U100._RESET | v83.34,59.85 83.34,23.8 83.07,23.53 83.07,21.36 82.8,21.08
_DBEN
  Bottom 0.127: CN100._DBEN 76.2,9.18 77.07,10.05 77.07,10.77 77.03,10.81 77.03,17.17 77.69,17.83 79.25,17.83 79.75,18.33 79.75,19.04 78.9,19.89 CN101.A29
_DMAEN  (via drill 0.3)
  Top 0.127: CN100._DMAEN 53.38,4.7 54.83,3.25 88.45,3.25 v88.74,2.96
  Bottom 0.127: v88.74,2.96 88.74,5.53 88.03,6.24 88.03,6.96 88.74,7.67 88.74,9.34 88.03,10.05 88.03,15.61 88.75,16.33 88.75,17.63 88.05,18.33 88.05,20.33 CN101.A39
_DS  (via drill 0.3, 0.3 pad 0.6)
  Top 0.127: v75.09,9.37 77.1,9.37 77.28,9.54 84.18,9.54 84.69,10.05 84.69,11.66 86.36,13.34 86.36,13.4 87.31,14.36 87.31,16.1 87.81,16.59 | 87.81,16.59 CN101.B38 | v103.82,25.24 v88.9,25.24 | v88.24,22.12 88.24,21.69 88.07,21.53 88.07,16.86 87.81,16.59 | U201._DS v73.82,45.88 | v73.85,32.07 v88.9,32.07
  Bottom 0.127: CN100._DS 74.23,8.51 v75.09,9.37 | U100._DS 103.98,46.35 103.82,46.2 v103.82,25.24 | v88.24,22.12 88.9,22.78 v88.9,25.24 v88.9,32.07 | v73.82,45.88 73.82,38.57 73.94,38.44 73.94,38.08 73.85,37.98 v73.85,32.07
_DSACK0  (via drill 0.3, 0.3 pad 0.6)
  Top 0.127: CN100._DSACK0 67.31,4.6 68.1,3.81 90.17,3.81 v90.81,3.17 | U100._DSACK0 86.52,56.52 | 86.52,56.52 78.2,56.52 78.15,56.56 59.01,56.56 v58.9,56.67 | v59.34,38.42 59.34,36.41 U201._DSACK0 | 86.52,56.52 90.65,56.52 v90.66,56.53
  Bottom 0.127: v90.81,3.17 90.81,4.1 91.04,4.34 91.04,5.77 90.57,6.24 90.57,7.68 91.04,8.15 91.04,9.58 90.57,10.05 90.57,10.77 90.81,11.01 90.75,11.06 90.75,17.04 90.05,17.74 90.05,20.33 90.84,21.12 | 90.84,21.12 CN101.A41 | v58.9,56.67 58.9,38.87 v59.34,38.42 | v90.66,56.53 90.66,23.59 90.73,23.53 90.73,21.24 90.84,21.12
_DSACK1  (via drill 0.3 pad 0.6)
  Top 0.127: CN100._DSACK1 11.43,12.7 12.86,14.13 23.18,14.13 32.23,23.18 CN101.A2 49.85,23.24 49.85,24.45 50.17,24.77 52.96,24.77 52.98,24.75 53.38,24.75 54.02,25.39 v59.84,25.39 | U100._DSACK1 106.04,53.98 106.83,54.77 v109.22,54.77 | v109.38,47.8 80.63,47.8 v80.17,48.26 | v80.01,43.97 v59.69,43.97 | v59.84,39.21 60.48,39.21 60.8,38.89 U201._DSACK1
  Bottom 0.127: v109.22,54.77 109.22,47.96 v109.38,47.8 | v80.17,48.26 80.17,44.13 v80.01,43.97 | v59.69,43.97 59.69,39.36 v59.84,39.21 v59.84,25.39
_EBCLR
  Top 0.127: CN100._EBCLR 85.09,9.42 85.25,9.58 85.25,11.43 89.03,15.21 89.03,15.81 CN101.B40
_ECS  (via drill 0.3)
  Top 0.127: v74.93,7.46 75.83,7.46 76,7.64 82.91,7.64 84.97,9.7 84.97,11.55 88.75,15.33 88.75,18.54 CN101.B39
  Bottom 0.127: CN100._ECS 74.07,6.6 v74.93,7.46
_EMUL  (via drill 0.3, 0.3 pad 0.6)
  Top 0.127: CN101.A36 84.75,22.04 84.55,22.04 84.05,21.54 84.05,18.33 84.77,17.61 84.77,14.29 83.98,13.49 75.72,13.49 v75.41,13.81 | v73.98,10.32 73.98,7.3 v72.71,6.03 | U100._CDIS 128.59,51.44 127.8,52.23 101.75,52.23 101.28,51.75 v86.04,51.75
  Bottom 0.127: v75.41,13.81 75.41,11.75 v73.98,10.32 | v72.71,6.03 72.71,5.81 75.64,5.81 75.97,5.47 75.97,5 74.52,3.55 31.67,3.55 30.52,4.7 CN100._EMUL 28.43,5.48 27.47,5.48 27.14,5.81 26.36,5.81 23.95,3.4 10.53,3.4 8.8,5.13 8.8,11.93 12.16,15.3 23.55,15.3 29.05,20.8 29.05,49.21 28.89,49.37 MMUSEL.1 | v86.04,51.75 86.04,23.33 CN101.A36
_FPUCS  (via drill 0.3)
  Top 0.127: R200.2 19.53,33.5 20,33.97 56.83,33.97 56.99,34.13 U201._CS 56.99,34.51 v57.36,34.13 | v57.63,30.48 v98.11,30.48
  Bottom 0.127: CN100._FPUCS 96.52,13.97 96.04,14.45 96.04,16.54 95.97,16.61 | 95.97,16.61 CN101.B46 | v57.36,34.13 57.36,30.74 v57.63,30.48 | 95.97,16.61 97.22,17.86 97.24,17.86 98.07,18.69 98.07,19.19 99.73,20.84 99.73,21.84 100.73,22.84 100.73,29.19 99.1,30.81 98.7,30.81 98.37,30.48 v98.11,30.48
_FPURST  (via drill 0.3)
  Top 0.127: 86.85,18.64 CN101.B37 | 86.85,18.64 86.75,18.54 86.75,14.19 84.12,11.56 82.69,11.56 82.15,11.02 81.89,11.02 CN100._FPURST | U201._RESET 74.93,54.77 75.45,55.29 78.15,55.29 78.23,55.21 v86.84,55.21 | v86.84,24.29 86.84,22.29 86.07,21.53 86.07,19.41 86.85,18.64
  Bottom 0.127: v86.84,55.21 v86.84,24.29
_FPUSIZE  (via drill 0.3)
  Top 0.127: U201.SIZE 50.64,48.42 v49.53,49.53 | v50.64,38.42 52.26,38.42 U201.A0 | v49.8,47.42 v49.8,47.41 49.21,46.83 39.32,46.83 R101.2
  Bottom 0.127: v49.53,49.53 49.53,48.52 49.43,48.42 49.43,47.78 v49.8,47.42 50.5,46.72 50.5,38.56 v50.64,38.42
_HLT  (via drill 0.3 pad 0.6)
  Top 0.127: v105.55,54.98 99.63,54.98 98.9,54.25 48.69,54.25 v48.58,54.13 | v48.1,25.24 v53.18,25.24
  Bottom 0.127: CN100._HLT 10.16,9.18 11.03,10.05 11.03,13.41 12.38,14.76 25.56,14.76 28.73,17.94 47.22,17.94 47.34,17.82 52.03,17.82 52.84,18.62 | 52.84,18.62 CN101.B5 | U100._HALT 105.57,51.44 105.79,51.66 105.79,54.74 v105.55,54.98 | v48.58,54.13 48.58,35.07 48.45,34.95 48.45,25.59 v48.1,25.24 | v53.18,25.24 53.18,23.63 53.07,23.53 53.07,22.18 53.72,21.53 53.72,20.84 53.18,20.3 53.18,18.97 52.84,18.62
_INT2  (via drill 0.3)
  Top 0.127: CN100._INT2 60.96,11.11 61.2,11.35 72.16,11.35 73.9,13.09 84.85,13.09 v84.93,13.18
  Bottom 0.127: v84.93,13.18 84.93,18.65 CN101.B35
_INT6  (via drill 0.3)
  Top 0.127: CN100._INT6 38.14,4.7 40.7,2.13 78.82,2.13 79.46,1.5 85.29,1.5 v86.2,2.4
  Bottom 0.127: v86.2,2.4 86.2,5.53 85.49,6.24 85.49,6.96 86.2,7.67 86.2,9.34 85.49,10.05 85.49,10.77 86.75,12.04 86.75,17.63 86.05,18.33 86.05,20.33 CN101.A37
_IPEND  (via drill 0.3 pad 0.6)
  Top 0.127: CN100._IPEND 84.81,6.6 86.24,8.03 86.24,8.67 87.51,9.94 87.51,12.7 91.03,16.22 91.03,17.69 91.18,17.83 91.25,17.83 91.75,18.33 91.75,18.83 93.75,20.83 93.75,23.04 93.84,23.13 | 93.84,23.13 CN101.A44 | U100._IPEND 132.56,60.01 132.4,60.17 130.02,60.17 127.8,62.39 127.15,62.39 125.57,60.8 94.14,60.8 v93.66,61.28 | v94.46,24.75 94.46,23.74 93.84,23.13
  Bottom 0.127: v93.66,61.28 93.66,25.54 v94.46,24.75
_IPL0  (via drill 0.3 pad 0.6)
  Top 0.127: CN100._IPL0 87.4,7.64 87.99,7.64 88.5,8.15 88.5,8.87 88.42,8.95 88.42,9.21 88.76,9.54 89.26,9.54 89.77,10.05 89.77,13.97 91.36,15.55 92.37,15.55 93.03,16.22 93.03,17.22 93.79,17.97 94.19,17.97 CN101.B45 | v131.6,30.16 107.15,30.16 106.74,29.75 98.78,29.75 98.67,29.86 v95.09,29.86 | D1.A 132.72,51.28 U100._IPL0
  Bottom 0.127: U100._IPL0 132.56,50.01 131.77,49.22 131.77,30.32 v131.6,30.16 | v95.09,29.86 95.09,23.54 95.07,23.53 95.07,22.18 95.73,21.53 95.73,19.51 CN101.B45
_IPL1  (via drill 0.3 pad 0.6)
  Top 0.127: CN100._IPL1 88.9,8.79 90.05,9.94 90.05,13.85 90.17,13.97 91.19,13.97 CN101.B44 | v133.35,79.06 104.89,79.06 104.8,79.15 92.62,79.15 v92.23,79.53 | D2.A 133.51,53.02 U100._IPL1
  Bottom 0.127: U100._IPL1 132.56,55.4 133.35,56.19 v133.35,79.05 v133.35,79.06 | v92.23,79.53 92.23,48.67 93.31,47.59 93.31,24.94 94.73,23.53 94.73,22.84 93.9,22.02 CN101.B44
_IPL2  (via drill 0.3 pad 0.6)
  Top 0.127: CN100._IPL2 91.44,9.18 92.31,10.05 92.31,13.5 95.03,16.22 95.03,17.22 96.03,18.22 96.03,20.32 CN101.A47 | v129.06,29.67 107.35,29.67 v107.34,29.66 | v107.31,28.56 96.98,28.56 v96.84,28.42 | U100._IPL2 131.44,53.98 132.23,54.77 D3.A
  Bottom 0.127: U100._IPL2 130.02,52.55 129.23,51.76 129.23,29.83 v129.06,29.67 | v107.34,29.66 107.34,28.59 v107.31,28.56 | v96.84,28.42 96.84,21.25 CN101.A47
_MMUDIS
  Top 0.127: U100._MMUDIS 132.07,56.52 130.32,54.77 129.69,54.77 129.23,54.3 127.95,53.02 121.91,53.02 121.79,53.15 107.81,53.15 107.59,52.93 51.12,52.93 51.03,53.02 27.46,53.02 MMUSEL.2
_MMUMANUAL  (via drill 0.3)
  Top 0.127: MMUMANUAL.2 24.29,39.85 v24.13,40.01
  Bottom 0.127: v24.13,40.01 24.13,54.29 24.29,54.45 MMUSEL.3
_NMI
  Top 0.127: 150.7,54.55 150.7,51.34 | 150.7,54.55 D3.C | 150.7,51.15 150.7,51.34 | 150.7,51.15 150.7,47.67 NMI.2 | 150.7,51.34 D2.C 150.7,54.55 | D1.C 150.7,51.15
_OCS
  Bottom 0.127: CN100._OCS 96.52,8.47 97.51,9.46 97.51,10.49 98.58,11.56 99.12,11.56 102.75,15.2 102.75,17.33 103.75,18.33 103.75,18.82 104.93,20 104.93,21.15 CN101.A55
_PI2C+  (via drill 0.3)
  Top 0.127: CN100._PI2C+ 61,4.7 62.17,3.53 89.34,3.53 v89.69,3.17
  Bottom 0.127: v89.69,3.17 89.69,3.94 89.3,4.34 89.3,5.77 89.77,6.24 89.77,7.68 89.3,8.15 89.3,9.58 89.77,10.05 89.77,15.61 89.05,16.33 89.05,17.63 89.75,18.33 89.75,23.04 CN101.A40
_PLSTERM  (via drill 0.3 pad 0.6)
  Top 0.127: CN100._PLSTERM 24.13,13.1 31.14,20.12 46.91,20.12 v47.64,19.38 48.2,19.38 CN101.B1 | U100._STERM 99.39,53.98 v99.38,53.99 | v99.38,66.83 v47.62,66.83
  Bottom 0.127: v99.38,53.99 v99.38,66.83 | v47.62,66.83 47.62,25.46 47.61,25.44 47.61,19.41 v47.64,19.38
_RAMSLOT
  Bottom 0.127: CN100._RAMSLOT 17.78,9.18 18.65,10.05 18.65,13.57 19.01,13.93 25.99,13.93 28.42,16.35 49.03,16.35 49.55,15.83 51.05,15.83 CN101.B4
_RESET
  Top 0.127: CN100._RESET 87.63,9.66 87.79,9.82 87.79,12.38 91.24,15.83 92.25,15.83 92.75,16.33 92.75,17.33 93.75,18.33 93.75,20.04 CN101.A45
_RMC  (via drill 0.3)
  Top 0.127: U100._RMC 99.91,66.67 99.58,66.34 99.17,66.34 99.16,66.36 v77.47,66.36 | v77.42,36.2 80.14,36.2 v80.17,36.23 | v80.17,24.45 78.26,24.45 77.95,24.13 77.95,23.23 CN101.A28
  Bottom 0.127: CN100._RMC 78.74,9.18 77.87,10.05 77.87,15.45 78.75,16.33 78.75,16.94 80.03,18.22 80.03,19.15 79.75,19.43 79.75,21.54 79.25,22.04 79.05,22.04 CN101.A28 | v77.47,66.36 77.47,36.24 v77.42,36.2 | v80.17,36.23 v80.17,24.45
_SBR
  Top 0.127: CN100._SBR 16.51,13.18 16.9,13.57 23.41,13.57 30.8,20.95 47.56,20.95 48.18,20.33 49.62,20.33 50.05,20.76 50.05,21.54 50.55,22.04 50.75,22.04 CN101.A4
_SCSI  (via drill 0.3)
  Top 0.127: CN100._SCSI 52.11,10.41 52.98,9.54 59.97,9.54 61.87,7.64 70.21,7.64 72.27,9.7 72.27,10.6 73.94,12.26 82.86,12.26 v83,12.13
  Bottom 0.127: v83,12.13 83,13.15 83.34,13.49 83.34,16.04 83.05,16.33 83.05,18.54 CN101.B33
_SENSEZ3P+
  Bottom 0.127: CN100._SENSEZ3P+ 83.82,10.87 86.07,13.11 86.07,15.32 85.9,15.49 CN101.B36
_WAIT  (via drill 0.3)
  Top 0.127: CN100._WAIT 45.76,4.7 47.49,2.97 87.34,2.97 v87.63,2.68
  Bottom 0.127: v87.63,2.68 87.63,3.47 86.76,4.34 86.76,5.06 87.63,5.93 87.63,7.28 86.76,8.15 86.76,8.87 87.63,9.74 87.63,15.75 87.05,16.33 87.05,17.63 87.75,18.33 87.75,23.04 CN101.A38
A0  (via drill 0.3)
  Top 0.127: CN100.A0 30.48,9.18 31.35,10.05 31.35,12.3 34.92,15.88 49.51,15.88 49.55,15.83 61.05,15.83 CN101.B12 60.96,17.62 58.42,17.62 57.94,18.1 57.94,21.75 59.21,23.02 v60.33,23.02 | v104.62,78.71 60.36,78.71 v60.33,78.74
  Bottom 0.127: U100.A0 v104.62,78.71 | v60.33,78.74 v60.33,23.02
A1  (via drill 0.3)
  Top 0.127: CN100.A1 33.02,9.05 32.07,10 32.07,12.23 35.16,15.32 49.28,15.32 49.32,15.28 62.49,15.28 CN101.B14 63.9,17.03 63.82,17.11 63.82,21.63 64.6,22.41 v64.6,22.45 | v110.81,72.49 66.58,72.49 66.51,72.42 56.07,72.42 v56.04,72.39 | v56.04,39.53 U201.A1 | v56.04,25.88 v64.77,25.88
  Bottom 0.127: U100.A1 110.49,64.14 110.81,64.45 v110.81,72.49 | v56.04,72.39 v56.04,39.53 v56.04,25.88 | v64.77,25.88 64.77,22.62 v64.6,22.45
A2  (via drill 0.3)
  Top 0.127: CN100.A2 35.56,9.18 34.69,10.05 34.69,10.77 34.74,10.82 34.74,14.1 35.39,14.76 49.04,14.76 49.09,14.72 63.93,14.72 CN101.B16 65.88,16.7 65.88,21.75 66.2,22.07 v66.2,22.17 | U100.A2 132.56,62.71 132.24,63.02 54.61,63.02 v54.45,63.18 | v54.45,40.8 U201.A2 | v54.45,26.83 v66.04,26.83
  Bottom 0.127: v54.45,63.18 v54.45,40.8 v54.45,26.83 | v66.04,26.83 66.04,26.12 66.39,25.77 66.39,24.01 66.72,23.68 66.72,22.84 66.2,22.32 v66.2,22.17
A3  (via drill 0.3)
  Top 0.127: CN100.A3 38.1,9.05 37.15,10 37.15,13.88 37.47,14.2 48.81,14.2 48.85,14.16 65.37,14.16 CN101.B18 68.07,16.86 68.07,21.53 68.72,22.18 68.72,22.39 69.13,22.79 69.07,22.84 69.07,25.1 69.37,25.4 69.37,26.19 69.22,26.35 55.12,26.35 v55.09,26.39 | U100.A3 130.02,62.77 74.99,62.77 v74.77,62.55 | v74.77,63.66 55.25,63.66 v55.09,63.5 | v55.09,42.07 U201.A3
  Bottom 0.127: v74.77,62.55 v74.77,63.66 | v55.09,63.5 v55.09,42.07 v55.09,26.39
A4  (via drill 0.3)
  Top 0.127: CN100.A4 40.64,9.18 39.77,10.05 39.77,10.39 39.69,10.48 39.69,13.32 40,13.64 48.58,13.64 48.62,13.6 66.81,13.6 CN101.B20 70.01,16.79 70.01,22.13 70.72,22.84 70.72,23.53 70.01,24.24 v70.01,24.45 | U100.A4 132.56,65.25 v55.4,65.25 | v55.53,43.34 U201.A4 | v55.53,27.3 v69.69,27.3
  Bottom 0.127: v55.4,65.25 55.4,63.81 55.53,63.68 v55.53,43.34 v55.53,27.3 | v70.01,24.45 70.01,26.99 v69.69,27.3
A5  (via drill 0.3)
  Top 0.127: CN100.A5 43.18,9.18 44.05,10.05 44.05,12.78 44.33,13.06 48.38,13.06 48.39,13.04 68.25,13.04 CN101.B22 72.07,16.86 72.07,21.53 72.19,21.64 v72.19,22.07 | U100.A5 130.02,64.93 129.95,64.99 72.42,64.99 v72.23,64.8
  Bottom 0.127: v72.23,64.8 72.23,38.57 71.79,38.12 71.79,24.46 72.72,23.53 72.72,22.6 v72.19,22.07
A6  (via drill 0.3)
  Top 0.127: CN100.A6 45.72,9.18 46.59,10.05 46.59,12.14 46.95,12.5 48.14,12.5 48.16,12.48 69.7,12.48 CN101.B24 74.07,16.86 74.07,21.53 74.19,21.64 v74.19,22.07 | U100.A6 127.48,60.48 76.2,60.48 v76.04,60.64
  Bottom 0.127: v76.04,60.64 76.04,25.56 74.93,24.45 74.93,24.29 74.77,24.13 74.77,22.64 v74.19,22.07
A7  (via drill 0.3)
  Top 0.127: CN100.A7 48.26,9.18 49.13,10.05 49.13,11.51 49.53,11.91 71.12,11.91 CN101.B26 76.07,16.86 76.07,21.53 76.19,21.64 v76.19,22.17 | U100.A7 132.56,67.79 132.4,67.94 76.84,67.94 v76.68,67.79
  Bottom 0.127: v76.68,67.79 76.68,23.58 76.72,23.53 76.72,22.7 v76.19,22.17
A8  (via drill 0.3)
  Top 0.127: CN100.A8 31.75,12.3 35.04,15.6 49.39,15.6 49.43,15.55 61.97,15.55 62.75,16.33 62.75,18.54 | 62.75,18.54 CN101.B13 | U100.A8 130.02,67.31 129.63,67.69 77.21,67.69 76.86,67.34 62.58,67.34 v62.55,67.31 | v62.13,22.17 62.13,21.58 62.07,21.53 62.07,19.21 62.75,18.54
  Bottom 0.127: v62.55,67.31 62.55,23.7 62.72,23.53 62.72,22.77 v62.13,22.17
A9  (via drill 0.3)
  Top 0.127: CN100.A9 34.29,14.05 35.27,15.04 49.16,15.04 49.2,15 63.41,15 64.75,16.33 64.75,18.54 64.86,18.65 | 64.86,18.65 CN101.B15 | U100.A9 127.48,63.82 127,63.34 75.71,63.34 74.95,64.1 65.28,64.1 v65.25,64.14 | 65.31,22.19 65.31,22.2 | 65.31,22.19 65.12,22.01 64.56,22.01 64.07,21.53 64.07,20.84 64.86,20.05 64.86,18.65 | v65.7,25.24 65.7,24.15 65.07,23.53 65.07,22.84 65.31,22.61 65.31,22.19
  Bottom 0.127: v65.7,25.24 65.25,25.69 v65.25,64.14
A10  (via drill 0.3)
  Top 0.127: CN100.A10 36.83,14.13 37.18,14.48 48.93,14.48 48.97,14.44 64.86,14.44 66.75,16.33 66.75,18.54 CN101.B17 66.9,20.02 67.72,20.84 67.72,21.53 66.9,22.35 66.9,24.2 v67.47,24.77 | U100.A10 132.56,68.42 132.33,68.2 76.89,68.2 76.86,68.23 63.09,68.23 v62.9,68.42 | v63.02,27.94 v67.47,27.94
  Bottom 0.127: v62.9,68.42 62.9,67.58 62.99,67.49 62.99,67.13 62.9,67.04 62.9,28.07 v63.02,27.94 | v67.47,24.77 v67.47,27.94
A11  (via drill 0.3)
  Top 0.127: CN100.A11 39.37,13.49 39.8,13.92 48.7,13.92 48.74,13.88 66.3,13.88 68.75,16.33 68.75,17.04 68.74,17.05 68.74,18.52 CN101.B19 69.72,19.51 69.72,21.53 69.31,21.94 v69.31,22.34 | v126.21,73.38 69.09,73.38 v69.06,73.34
  Bottom 0.127: U100.A11 126.05,64.14 126.21,64.29 v126.21,73.38 | v69.06,73.34 69.06,22.59 v69.31,22.34
A12  (via drill 0.3)
  Top 0.127: CN100.A12 41.91,12.22 43.02,13.34 48.49,13.34 48.51,13.32 67.74,13.32 70.75,16.33 70.75,18.54 CN101.B21 71.72,19.51 71.72,21.53 71.31,21.94 v71.31,22.2 | v128.75,72.55 121.37,72.55 120.87,72.05 71.73,72.05 v71.6,71.91
  Bottom 0.127: U100.A12 128.43,66.67 128.59,66.83 128.59,72.39 v128.75,72.55 | v71.6,71.91 71.6,38.29 71.07,37.77 71.07,22.84 71.31,22.61 v71.31,22.2
A13  (via drill 0.3)
  Top 0.127: CN100.A13 44.45,12.7 44.53,12.78 48.26,12.78 48.27,12.76 69.18,12.76 72.75,16.33 72.75,18.54 CN101.B23 72.9,20.02 73.72,20.84 73.72,21.53 72.87,22.39 72.87,24.45 73.82,25.4 v74.93,25.4 | U100.A13 130.02,70.96 129.86,71.12 119.16,71.12 118.77,70.72 75.33,70.72 v75.25,70.64
  Bottom 0.127: v75.25,70.64 75.25,25.72 v74.93,25.4
A14  (via drill 0.3)
  Top 0.127: CN100.A14 46.99,11.91 47.3,12.22 48.03,12.22 48.04,12.2 70.62,12.2 74.75,16.33 74.75,18.54 CN101.B25 74.9,20.02 75.72,20.84 75.72,21.53 74.72,22.53 74.72,23.53 74.45,23.8 v74.45,24.61 | U100.A14 124.94,66.04 124.4,65.5 74.52,65.5 v74.3,65.72
  Bottom 0.127: v74.3,65.72 74.3,24.77 v74.45,24.61
A15  (via drill 0.3)
  Top 0.127: CN100.A15 49.53,11.43 49.73,11.63 72.05,11.63 76.75,16.33 76.75,18.54 CN101.B27 77.72,19.51 77.72,21.53 77.07,22.18 77.07,23.53 77.42,23.87 v77.42,24.61 | U100.A15 127.48,70.8 127.41,70.87 119.27,70.87 118.88,70.47 78.45,70.47 v78.26,70.28
  Bottom 0.127: v78.26,70.28 78.26,25.45 v77.42,24.61
A16  (via drill 0.3)
  Top 0.127: U100.A16 122.4,65.88 122.27,65.75 74.89,65.75 74.48,66.17 74.11,66.17 73.99,66.04 v61.63,66.04
  Bottom 0.127: CN100.A16 52.07,13.49 54.77,16.19 54.77,17.15 55.45,17.83 57.25,17.83 57.75,18.33 57.77,18.4 57.77,21.65 58.59,22.47 61.18,22.47 CN101.A12 61.63,23.46 v61.63,66.04
A17  (via drill 0.3)
  Top 0.127: U100.A17 124.94,70.48 124.81,70.61 119.38,70.61 118.98,70.22 78.82,70.22 78.45,69.84 78.08,69.84 77.75,70.17 v61.12,70.17 | v61.12,41.91 63.5,41.91 v63.66,41.75
  Bottom 0.127: CN100.A17 54.61,9.21 54.13,9.68 54.13,9.98 54.21,10.05 54.21,14.84 55.09,15.72 62.14,15.72 62.75,16.33 62.75,17.19 63.66,18.1 63.66,18.24 63.75,18.33 63.75,23.04 63.89,23.17 | 63.89,23.17 CN101.A14 | v61.12,70.17 v61.12,41.91 | v63.66,41.75 63.66,23.4 63.89,23.17
A18  (via drill 0.3)
  Top 0.127: v121.13,72.94 69.27,72.94 69.24,72.9 66.36,72.9 v66.32,72.87
  Bottom 0.127: CN100.A18 57.15,14.61 57.7,15.16 63.58,15.16 64.75,16.33 64.75,17.33 65.75,18.33 65.75,23.04 CN101.A16 65.9,23.67 66.14,23.91 66.14,25.66 65.6,26.2 65.6,27.01 66.32,27.74 v66.32,72.87 | U100.A18 121.13,64.14 v121.13,72.94
A19  (via drill 0.3)
  Top 0.127: v68.58,24.45 68.58,23.86 CN101.A18 | v68.58,29.05 122.75,29.05 v122.91,29.21
  Bottom 0.127: CN100.A19 59.69,14.29 60,14.6 65.02,14.6 66.75,16.33 66.75,17.33 67.75,18.33 67.75,23.04 CN101.A18 | U100.A19 122.4,67.79 121.61,67 121.61,63.81 123.44,61.97 123.44,37.57 122.91,37.03 v122.91,29.21 | v68.58,29.05 v68.58,24.45
A20  (via drill 0.3)
  Top 0.127: v120.68,71.61 71.92,71.61 71.78,71.47 70.2,71.47 v70.17,71.44
  Bottom 0.127: CN100.A20 62.23,13.65 62.62,14.04 66.46,14.04 68.75,16.33 68.75,17.33 69.75,18.33 69.75,23.04 CN101.A20 70.45,23.74 70.45,26.91 70.17,27.19 v70.17,71.44 | U100.A20 120.65,66.67 120.87,66.9 120.87,71.42 v120.68,71.61
A21  (via drill 0.3)
  Top 0.127: v122.36,32.03 114.42,32.03 113.12,30.73 105.49,30.73 105.27,30.96 v73.5,30.96 | v73.5,25.72 71.91,25.72 71.75,25.56 71.75,23.33 CN101.A22
  Bottom 0.127: CN100.A21 64.77,13.18 65.08,13.48 67.9,13.48 70.75,16.33 70.75,17.33 71.75,18.33 71.75,23.04 CN101.A22 | U100.A21 119.86,67.79 119.07,67 119.07,46.82 121.09,44.79 121.09,39.55 121.57,39.08 121.57,34.62 122.36,33.82 v122.36,32.03 | v73.5,30.96 v73.5,25.72
A22  (via drill 0.3)
  Top 0.127: v118.59,71.17 73.11,71.17 v73.06,71.12
  Bottom 0.127: CN100.A22 67.31,12.1 71.04,15.83 72.25,15.83 72.75,16.33 72.75,17.33 73.75,18.33 73.75,23.04 CN101.A24 73.06,24.03 v73.06,71.12 | U100.A22 118.43,66.67 118.59,66.83 v118.59,71.17
A23  (via drill 0.3)
  Top 0.127: v114.65,35.05 77.66,35.05 v77.63,35.08 | v77.42,25.24 76.2,25.24 76.04,25.08 76.04,23.33 CN101.A26
  Bottom 0.127: CN100.A23 69.85,11.43 74.75,16.33 74.75,17.33 75.75,18.33 75.75,23.04 CN101.A26 | U100.A23 117.32,67.79 116.08,66.56 116.08,41.89 116.27,41.7 116.27,39.42 116.53,39.17 116.53,37.33 115.54,37.33 115.28,37.59 114.91,37.59 114.65,37.33 v114.65,35.05 | v77.63,35.08 77.63,25.45 v77.42,25.24
A24  (via drill 0.3)
  Top 0.127: v113.91,35.49 79.13,35.49 v78.9,35.72 | v78.71,28.42 62.26,28.42 v62.11,28.26 | v62.07,25.08 v63.02,25.08
  Bottom 0.127: CN100.A24 51.84,7.64 52.43,7.64 52.94,8.15 52.94,8.87 52.35,9.46 52.35,13.38 55.05,16.07 55.05,17.04 55.55,17.54 58.02,17.54 58.1,17.62 58.1,18.28 58.05,18.33 58.05,21.54 58.7,22.19 61.48,22.19 62.49,21.18 62.82,21.18 | 62.82,21.18 CN101.A13 | U100.A24 114.46,69.22 113.98,68.74 113.98,35.56 v113.91,35.49 | v78.9,35.72 78.9,28.61 v78.71,28.42 | v62.11,28.26 62.11,25.12 v62.07,25.08 | v63.02,25.08 63.02,21.39 62.82,21.18
A25  (via drill 0.3)
  Top 0.127: v116.05,76.67 v64.14,76.67 v64.14,76.68 | v65.25,24.61 64.45,24.61 v64.14,24.92
  Bottom 0.127: CN100.A25 54.38,7.64 54.97,7.64 55.48,8.15 55.48,8.87 54.49,9.86 54.49,14.64 55.28,15.44 62.25,15.44 63.03,16.22 63.03,17.07 64.03,18.07 64.03,20.32 CN101.A15 64.9,22.13 65.04,22.27 65.04,24.4 v65.25,24.61 | U100.A25 115.73,66.67 116.05,66.99 v116.05,76.67 | v64.14,76.68 v64.14,24.92
A26  (via drill 0.3)
  Top 0.127: v111.28,47.31 78.51,47.31 78.15,47.67 75.45,47.67 75.25,47.47 v66.99,47.47
  Bottom 0.127: CN100.A26 56.92,7.64 57.51,7.64 58.02,8.15 58.02,8.87 57.47,9.42 57.47,14.4 57.94,14.88 63.69,14.88 65.03,16.22 65.03,17.22 66.03,18.22 66.03,20.32 CN101.A17 66.9,22.66 66.98,22.74 66.98,23.79 66.73,24.03 66.73,24.4 66.83,24.5 v66.83,25.4 66.99,25.56 v66.99,47.47 | U100.A26 112.24,67.79 111.45,67 111.45,47.47 v111.28,47.31
A27  (via drill 0.3)
  Top 0.127: v113.51,77.11 v67.95,77.11
  Bottom 0.127: CN100.A27 59.45,7.64 60.05,7.64 60.56,8.15 60.56,8.87 59.97,9.46 59.97,13.96 60.33,14.32 65.13,14.32 67.03,16.22 67.03,17.22 68.03,18.22 68.03,20.32 68.72,21 | 68.72,21 CN101.A19 | U100.A27 113.35,66.67 113.51,66.83 v113.51,77.11 | 68.72,21 68.72,22.84 68.72,23.53 67.95,24.31 v67.95,77.11
A28  (via drill 0.3)
  Top 0.127: v108.59,50.16 78.2,50.16 78.15,50.21 75.45,50.21 75.41,50.16 v70.61,50.16
  Bottom 0.127: CN100.A28 62,7.64 62.59,7.64 63.1,8.15 63.1,8.87 62.51,9.46 62.51,13.3 62.97,13.76 66.57,13.76 69.03,16.22 69.03,17.22 70.03,18.22 70.03,20.32 70.81,21.09 | 70.81,21.09 CN101.A21 | U100.A28 109.22,69.22 108.68,68.67 108.68,50.26 v108.59,50.16 | v70.61,50.16 70.61,27.11 70.72,26.99 70.72,21.18 70.81,21.09
A29  (via drill 0.3)
  Top 0.127: v110.33,77.63 v72.39,77.63
  Bottom 0.127: CN100.A29 64.53,7.64 65.13,7.64 65.64,8.15 65.64,8.87 65.05,9.46 65.05,13.06 65.19,13.2 68.02,13.2 71.03,16.22 71.03,17.22 72.03,18.22 72.03,20.32 72.67,20.96 | 72.67,20.96 CN101.A23 | U100.A29 110.33,66.67 110.55,66.9 110.55,72.12 110.37,72.31 110.37,77.59 v110.33,77.63 | v72.39,77.63 72.39,65.27 72.67,64.99 72.67,64.62 72.48,64.43 72.48,38.31 72.67,38.12 72.67,23.94 72.98,23.63 72.98,21.34 72.67,21.04 72.67,20.96
A30  (via drill 0.3)
  Top 0.127: v75.32,24.06 75.79,24.52 75.79,25.19 76.79,26.19 v106.04,26.19
  Bottom 0.127: CN100.A30 67.08,7.64 67.67,7.64 68.18,8.15 68.18,8.87 67.59,9.46 67.59,11.99 71.16,15.55 72.37,15.55 73.03,16.22 73.03,17.22 74.03,18.22 74.03,20.32 CN101.A25 75.07,21.36 75.07,23.53 75.32,23.77 v75.32,24.06 | U100.A30 106.2,69.22 106.04,69.06 v106.04,26.19
A31  (via drill 0.3)
  Top 0.127: v108.43,78.26 v76.2,78.26
  Bottom 0.127: CN100.A31 69.61,7.64 70.21,7.64 70.72,8.15 70.72,8.87 70.13,9.46 70.13,10.48 70.21,10.56 70.21,11.4 75.03,16.22 75.03,17.22 76.03,18.22 76.03,20.32 76.86,21.14 | 76.86,21.14 CN101.A27 | U100.A31 108.27,66.67 108.43,66.83 v108.43,78.26 | 76.86,21.14 76.86,22.48 76.98,22.6 76.98,67.46 77.12,67.6 77.12,67.97 76.2,68.89 v76.2,78.26
CLK90
  Bottom 0.127: CN100.CLK90 91.44,15.94 91.05,16.33 91.05,18.54 CN101.B41
CPUCLK  (via drill 0.3, 0.3 pad 0.6, 0.35)
  Top 0.127: v100.97,57.94 36.21,57.94 v36.2,57.96 | FPUCLK.1 36.04,37.15 v36.2,36.99
  Top 0.152: CN101.B54 103.9,22 103.06,22.84 103.06,23.78 v102.24,24.61
  Bottom 0.127: v36.2,57.96 v36.2,52.07 v36.2,36.99 | U100.CLK v100.97,57.94
  Bottom 0.152: CN100.CPUCLK 97.79,6.83 99.06,8.1 99.06,8.73 100.01,9.68 100.01,11.65 103.32,14.95 103.32,16.1 CN101.B54 | v102.24,24.61 102.24,31.74 101.27,32.7 101.27,39.34 102.88,40.94 102.88,58.25 U100.CLK
D0  (via drill 0.3)
  Top 0.127: CN100.D0 119.38,9.18 118.51,10.05 118.51,11.35 117.85,12.01 114.58,12.01 CN101.B60 109.33,17.26 109.03,17.26 108.05,18.24 108.05,19.04 109.77,20.76 109.77,21.85 110.75,22.83 110.75,23.54 110.65,23.64 110.65,28.57 110.81,28.73 v142.56,28.73 | U201.D0 v62.07,62.39 | v62.07,76.04 63.03,76.04 63.22,76.23 142.05,76.23 v142.4,75.88 | v142.52,46.99 133.19,46.99 U100.D0
  Bottom 0.127: v62.07,62.39 v62.07,76.04 | v142.4,75.88 142.4,75.56 142.52,75.43 v142.52,46.99 142.52,28.77 v142.56,28.73
D1  (via drill 0.3)
  Top 0.127: CN100.D1 121.92,8.47 122.83,9.38 122.88,9.38 122.91,9.4 122.91,12.34 122.69,12.57 116.02,12.57 CN101.B62 111.33,17.26 111.12,17.26 110.05,18.33 110.05,19.04 111.77,20.76 111.77,21.85 112.75,22.83 112.75,23.54 112.71,23.58 112.71,24.73 | 112.71,24.73 112.71,24.77 | U201.D1 v63.34,62.39 | v63.34,75.72 64.3,75.72 64.56,75.97 141.35,75.97 v142.08,75.25 | v142.08,46.04 133.36,46.04 132.88,45.56 130.81,45.56 U100.D1 | v142.08,28.26 112.87,28.26 112.71,28.1 112.71,24.73
  Bottom 0.127: v63.34,62.39 v63.34,75.72 | v142.08,75.25 v142.08,46.04 v142.08,28.26
D2  (via drill 0.3)
  Top 0.127: CN100.D2 124.46,8.73 125.45,9.72 125.45,12.27 124.59,13.12 117.46,13.12 CN101.B64 113.33,17.26 113.12,17.26 112.05,18.33 112.05,19.04 113.77,20.76 113.77,21.85 114.75,22.83 114.75,24.27 | 114.78,24.61 114.75,24.58 114.75,24.27 | U201.D2 v64.61,62.39 | v64.61,75.41 65.42,75.41 65.73,75.72 140.97,75.72 v141.29,75.41 | v141.45,43.81 U100.D2 | v141.41,27.78 115.25,27.78 114.78,27.3 114.78,24.3 114.75,24.27
  Bottom 0.127: v64.61,62.39 v64.61,75.41 | v141.29,75.41 141.29,74.92 141.41,74.8 141.41,43.85 v141.45,43.81 141.45,27.82 v141.41,27.78
D3  (via drill 0.3, 0.35)
  Top 0.127: CN100.D3 127,8.73 127.99,9.72 127.99,13.14 127.44,13.68 118.9,13.68 CN101.B66 115.33,17.26 115.06,17.26 114.05,18.27 114.05,19.04 115.75,20.74 115.75,21.83 116.75,22.83 116.75,23.54 116.68,23.61 116.68,24.41 | 116.68,24.41 116.68,24.61 | U201.D3 v65.88,62.39 | v65.88,75.25 66.84,75.25 67.06,75.47 140.12,75.47 v140.97,74.61 | v140.97,27.3 139.69,27.3 139.57,27.43 116.97,27.43 116.68,27.15 116.68,25.23 116.56,25.11 116.56,24.74 116.68,24.62 116.68,24.41
  Top 0.152: U100.D3 140.92,41.27 v140.97,41.23
  Bottom 0.127: v65.88,62.39 v65.88,75.25 | v140.97,74.61 v140.97,41.23 v140.97,27.3
D4  (via drill 0.3)
  Top 0.127: CN100.D4 129.54,8.57 130.53,9.56 130.53,14.01 130.3,14.24 120.34,14.24 CN101.B68 | U201.D4 v67.15,62.39 | v67.15,74.93 67.95,74.93 68.24,75.21 68.6,75.21 68.79,75.03 139.76,75.03 v140.18,74.61 | v140.18,43.02 130.81,43.02 U100.D4
  Bottom 0.127: v67.15,62.39 v67.15,74.93 | v140.18,74.61 v140.18,43.02 140.18,9.21 139.86,8.89 139.86,7.46 139.7,7.3 137.58,7.3 137.49,7.39 130.33,7.39 CN100.D4
D5  (via drill 0.3)
  Top 0.127: CN100.D5 132.08,9.05 133.03,10 133.03,14.45 132.68,14.8 121.78,14.8 CN101.B70 119.33,17.26 119.03,17.26 118.05,18.24 118.05,19.04 119.75,20.74 119.75,22.13 119.05,22.83 119.05,23.54 119.06,23.55 119.06,24.77 119.22,24.92 119.22,26.83 119.38,26.99 138.61,26.99 138.62,26.99 v139.38,26.99 | U201.D5 v68.42,62.39 | v68.42,74.77 138.91,74.77 v139.38,74.3 | v139.38,47.94 129.06,47.94 U100.D5
  Bottom 0.127: v68.42,62.39 v68.42,74.77 | v139.38,74.3 v139.38,47.94 v139.38,26.99
D6  (via drill 0.3)
  Top 0.127: CN100.D6 134.62,9.18 135.49,10.05 135.49,10.77 135.41,10.85 135.41,14.45 134.46,15.4 123.19,15.4 CN101.B72 121.3,17.28 121.14,17.28 120.07,18.34 120.07,19.03 121.73,20.68 121.73,22.19 121.07,22.84 121.07,24.08 123.51,26.51 137.33,26.51 137.45,26.64 137.82,26.64 137.91,26.55 v138.43,26.55 | U201.D6 v69.69,62.39 | v69.69,74.3 70.65,74.3 70.87,74.52 73.79,74.52 73.98,74.33 136.53,74.33 136.71,74.52 137.89,74.52 v138.59,73.82 | v138.43,42.07 137.94,42.07 137.82,41.94 137.45,41.94 137.33,42.07 130.81,42.07 U100.D6
  Bottom 0.127: v69.69,62.39 v69.69,74.3 | v138.59,73.82 138.59,42.23 v138.43,42.07 v138.43,26.55
D7  (via drill 0.3)
  Top 0.127: CN100.D7 137.16,8.47 138.07,9.38 138.12,9.38 138.15,9.4 138.15,17.27 138.02,17.4 132.39,17.4 132.25,17.54 124.75,17.54 CN101.B74 122.75,17.83 122.55,17.83 122.05,18.33 122.05,21.54 122.75,22.24 122.75,25.24 123.7,26.19 v137.64,26.19 | U201.D7 v70.96,62.39 | v70.96,73.98 73.03,73.98 73.32,74.26 73.68,74.26 73.87,74.07 136.63,74.07 136.82,74.26 137.19,74.26 v137.64,73.82 | v137.64,42.39 128.91,42.39 U100.D7
  Bottom 0.127: v70.96,62.39 v70.96,73.98 | v137.64,73.82 v137.64,42.39 v137.64,26.19
D8  (via drill 0.3)
  Top 0.127: U201.D8 v73.5,62.39 | v73.5,73.82 v137,73.82 | v136.84,38.73 U100.D8 | v136.84,22.07 123.78,22.07 CN101.A73
  Bottom 0.127: CN100.D8 117.24,7 117.24,8.87 117.75,9.38 118.47,9.38 120.39,7.46 121.13,7.46 121.13,7.67 122.83,9.38 122.88,9.38 123.35,9.84 123.35,9.9 123.05,10.2 123.05,17.63 123.75,18.33 123.75,18.5 123.98,18.73 123.98,20.1 CN101.A73 | v73.5,62.39 v73.5,73.82 | v137,73.82 137,38.89 v136.84,38.73 v136.84,22.07
D9  (via drill 0.3)
  Top 0.127: U201.D9 101.44,58.58 101.75,58.26 v128.74,58.26 v128.75,58.26 | v128.11,30.96 124.81,30.96 124.75,30.89 122.55,30.89 v122.36,30.71 | v122.36,26.19 120.97,26.19 120.81,26.04 120.81,21.28 CN101.A71
  Bottom 0.127: CN100.D9 114.3,8.47 115.21,9.38 115.74,9.38 115.97,9.61 115.97,10.77 116.48,11.28 118.12,11.28 119.06,12.22 119.06,16.32 119.05,16.33 119.05,17.63 119.75,18.33 119.75,20.04 CN101.A71 | v128.75,58.26 128.75,42.55 U100.D9 127.48,39.85 128.27,39.06 128.27,31.5 128.11,31.34 v128.11,30.96 | v122.36,30.71 v122.36,26.19
D10  (via drill 0.3)
  Top 0.127: U201.D10 v123.98,57.31 | v123.82,35.63 v119.19,35.63
  Bottom 0.127: CN100.D10 111.76,8.57 113.35,10.16 113.35,10.95 114.46,12.06 116.21,12.06 116.84,12.7 116.84,14.29 117,14.45 117,17.46 117.77,18.23 117.77,20.05 CN101.A69 119.07,21.36 119.07,23.53 119.19,23.64 v119.19,35.63 | v123.98,57.31 123.98,44.77 U100.D10 124.94,42.39 123.89,41.35 123.89,35.7 v123.82,35.63
D11  (via drill 0.3)
  Top 0.127: U201.D11 101.44,56.04 101.75,55.72 130.34,55.72 130.66,56.04 v130.97,56.04 | v130.18,31.59 125.09,31.59 124.64,31.15 116.56,31.15 v116.52,31.11
  Bottom 0.127: CN100.D11 109.22,9.1 111.4,11.28 112.89,11.28 114.14,12.54 114.14,15.72 114.75,16.33 114.75,17.63 114.05,18.33 114.05,19.04 114.55,19.54 115.25,19.54 116.76,21.05 | 116.76,21.05 CN101.A67 | v130.97,56.04 130.97,39.69 U100.D11 130.02,31.75 v130.18,31.59 | v116.52,31.11 116.52,23.73 116.73,23.53 116.73,21.08 116.76,21.05
D12  (via drill 0.3)
  Top 0.127: v124.46,31.59 v114.65,31.59 | U201.D12 99.06,54.77 99.85,55.56 101.55,55.56 101.64,55.47 125.19,55.47 v125.89,54.77
  Bottom 0.127: CN100.D12 106.68,9.18 107.55,10.05 107.55,10.39 111.12,13.97 111.12,16.26 111.05,16.33 111.05,17.04 111.55,17.54 111.83,17.54 111.92,17.62 111.92,18.91 112.55,19.54 113.25,19.54 CN101.A65 114.73,21.36 114.73,23.53 114.65,23.6 v114.65,31.59 | v125.89,54.77 125.89,53.81 125.6,53.52 125.6,50.62 125.79,50.43 125.79,42.13 U100.D12 124.94,39.85 124.15,39.06 124.15,38.41 124.46,38.09 v124.46,31.59
D13  (via drill 0.3)
  Top 0.127: U201.D13 101.44,53.5 101.75,53.18 107.48,53.18 107.8,53.5 v126.21,53.5 | v127.48,36.2 125.24,36.2 125.12,36.07 v112.11,36.07
  Bottom 0.127: CN100.D13 104.14,9.18 105.01,10.05 105.01,10.39 107.79,13.18 107.79,14.29 109.06,15.56 109.06,16.32 109.05,16.33 109.05,17.33 109.77,18.05 109.77,19.15 110.43,19.82 111.53,19.82 CN101.A63 | CN101.A63 | v126.21,53.5 126.21,51.27 126.49,50.98 126.49,39.72 U100.D13 v127.48,36.2 | v112.11,36.07 112.11,31.86 112.2,31.77 112.2,25.91 113.35,24.77 113.35,23.8 113.07,23.53 113.07,21.36 CN101.A63
D14  (via drill 0.3)
  Top 0.127: U201.D14 v121.6,52.7 | U100.D14 120.97,41.27 120.18,42.07 117.15,42.07 116.71,42.51 v111.28,42.51 | v111.17,24.77 111.17,23.62 111.07,23.53 111.07,21.36 CN101.A61
  Bottom 0.127: CN100.D14 101.6,9.18 102.47,10.05 102.47,12.05 106.75,16.33 106.75,17.33 107.75,18.33 107.75,19.8 108.11,20.16 109.08,20.16 109.75,20.83 109.75,21.27 110.81,21.27 CN101.A61 | v121.6,52.7 121.6,42.07 U100.D14 | v111.28,42.51 111.28,24.88 v111.17,24.77
D15  (via drill 0.3)
  Top 0.127: U201.D15 101.44,50.96 101.75,50.65 107.48,50.65 107.64,50.8 v126.05,50.8 | v124.94,36.51 120.16,36.51 120.04,36.39 119.67,36.39 119.55,36.51 v108.46,36.51 | v108.74,24.61 108.74,21.34 CN101.A59